# Altium project MB1144C.PrjPCB (part 3 of 4)

## Sheet STPMS2&PT100.SchDoc: STPMS2&PT100
size A3; DocumentNumber: MB1144; Revision: C-02; SheetNumber: 21; SheetTotal: 25; Project: STM32L476G-EVAL; ModifiedDate: 9/23/2015
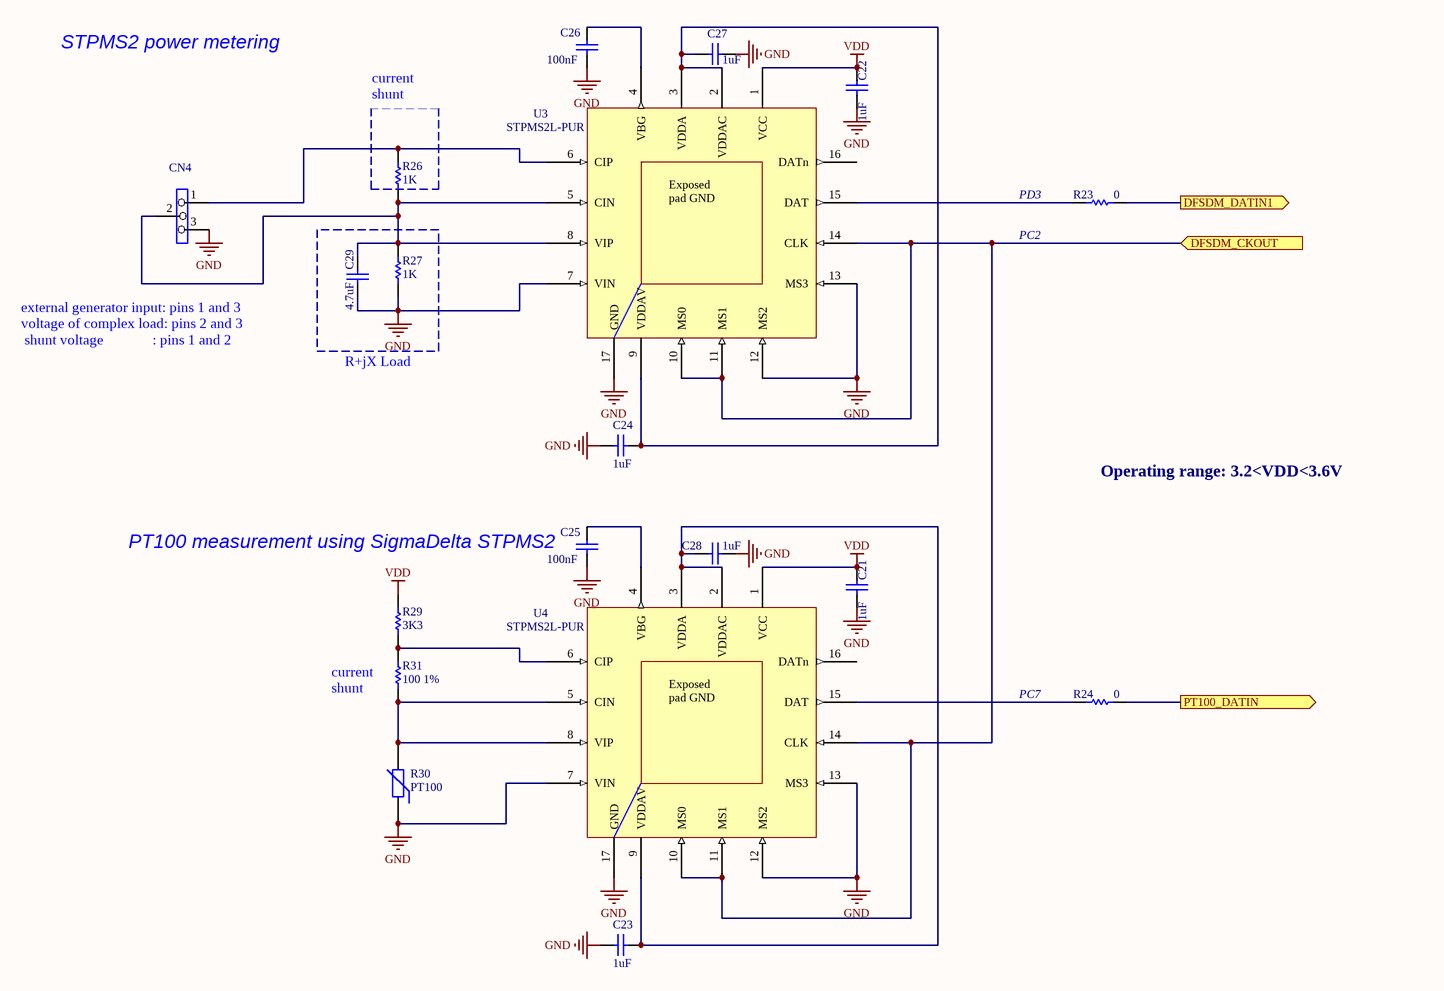
[diagram p15: STPMS2&PT100.SchDoc]

### Parts
C21  1uF  [0603C]
C22  1uF  [0603C]
C23  1uF  [0603C]
C24  1uF  [0603C]
C25  100nF  [0402C]
C26  100nF  [0402C]
C27  1uF  [0603C]
C28  1uF  [0603C]
C29  4.7uF  [0603C]
CN4  Header 3X1  [SIP3]  (value not drawn)
R23  0  [0603R]
R24  0  [0603R]
R26  1K  [0402R]
R27  1K  [0402R]
R29  3K3  [0402R]
R30  PT100  [HDR_1X2_1R27]
R31  100 1%  [0603R]
U3  STPMS2L-PUR  [QFN16_0R65_4X4]
U4  STPMS2L-PUR  [QFN16_0R65_4X4]

### Ports
DFSDM_CKOUT (in), DFSDM_DATIN1 (out), PT100_DATIN (out)

### Nets
GND: C21.2 C22.2 C23.1 C24.1 C25.1 C26.1 C27.2 C28.2 C29.2 CN4.3 R27.2 R30.1 U3.7(VIN) U3.12(MS2) U3.13(MS3) U3.17(GND) U4.7(VIN) U4.12(MS2) U4.13(MS3) U4.17(GND)
VDD: C21.1 C22.1 R29.1 U3.1(VCC) U4.1(VCC)
PD3: R23.1 ; port DFSDM_DATIN1
NetC23_2: C23.2 C28.1 U4.2(VDDAC) U4.3(VDDA) U4.9(VDDAV)
NetC24_2: C24.2 C27.1 U3.2(VDDAC) U3.3(VDDA) U3.9(VDDAV)
NetC25_2: C25.2 U4.4(VBG)
NetC26_2: C26.2 U3.4(VBG)
NetC29_1: C29.1 CN4.2 R26.2 R27.1 U3.5(CIN) U3.8(VIP)
NetCN4_1: CN4.1 R26.1 U3.6(CIP)
NetCN11_28: U3.10(MS0) U3.11(MS1) U3.14(CLK) U4.10(MS0) U4.11(MS1) U4.14(CLK) ; port DFSDM_CKOUT
NetR23_2: R23.2 U3.15(DAT)
NetR24_1: R24.1 ; port PT100_DATIN
NetR24_2: R24.2 U4.15(DAT)
NetR29_2: R29.2 R31.1 U4.6(CIP)
NetR30_2: R30.2 R31.2 U4.5(CIN) U4.8(VIP)

Not connected (* = marked no-connect by the designer): U3 16(DATn); U4 16(DATn)

### Notes on the sheet
- STPMS2 power metering
- current shunt
- (near R23) PD3
- PC2
- external generator input: pins 1 and 3
  voltage of complex load: pins 2 and 3
  shunt voltage              : pins 1 and 2
- R+jX Load
- PT100 measurement using SigmaDelta STPMS2
- Operating range: 3.2<VDD<3.6V
- (near R31) current shunt
- (near R24) PC7
- Title:
- Project:
- Size:
- Date:
- A3
- Reference:
- Sheet:
- Revision:
- of
- (in symbol STPMS2) Exposed pad GND

### Library data of the parts
C21-C24 C27-C29 = CAP: as C58 on sheet MCU2; Published: 8-Jun-2000; Revision: July-2002: Re-released for DXP Platform.; Publisher: Altium Limited
C25 C26 = Cap: as C12 on sheet SRAM&Flash; Published: 8-Jun-2000; Revision: July-2002: Re-released for DXP Platform.; Publisher: Altium Limited
CN4 = Jumper3: Ordered by: Subcon; ECCN_US/EU: NA
R23 R24 = res1: as R35 on sheet MCU2; Published: 8-Jun-2000; Revision: July-2002: Re-released for DXP Platform.; Publisher: Altium Limited
R26 R27 = Res1: as R268 on sheet ST_LINK; Published: 8-Jun-2000; Revision: July-2002: Re-released for DXP Platform.; Publisher: Altium Limited; Value: 1K
R29 R31 = Res1: as R33 on sheet MCU2; Published: 8-Jun-2000; Revision: July-2002: Re-released for DXP Platform.; Publisher: Altium Limited
R30 = PT100: Varistor (Voltage-Sensitive Resistor); ECCN_US/EU: NA; Ordered by: Subcon; Published: 24-Mar-1999; Revision: July-2002: Re-released for DXP Platform.; Publisher: Altium Limited
U3 U4 = STPMS2: STM sigmaDelta modulator; Ordered by: ST; ECCN_US/EU: EAR99/NEC; Ref St: 9177717; Manuf_1: ST; Manuf_Part_1: STPMS2L-PUR

## Sheet IDD_measurement.SchDoc: IDD_measurement
size A3; DocumentNumber: MB1144; Revision: C-02; SheetNumber: 19; SheetTotal: 25; Project: STM32L476G-EVAL; ModifiedDate: 9/23/2015
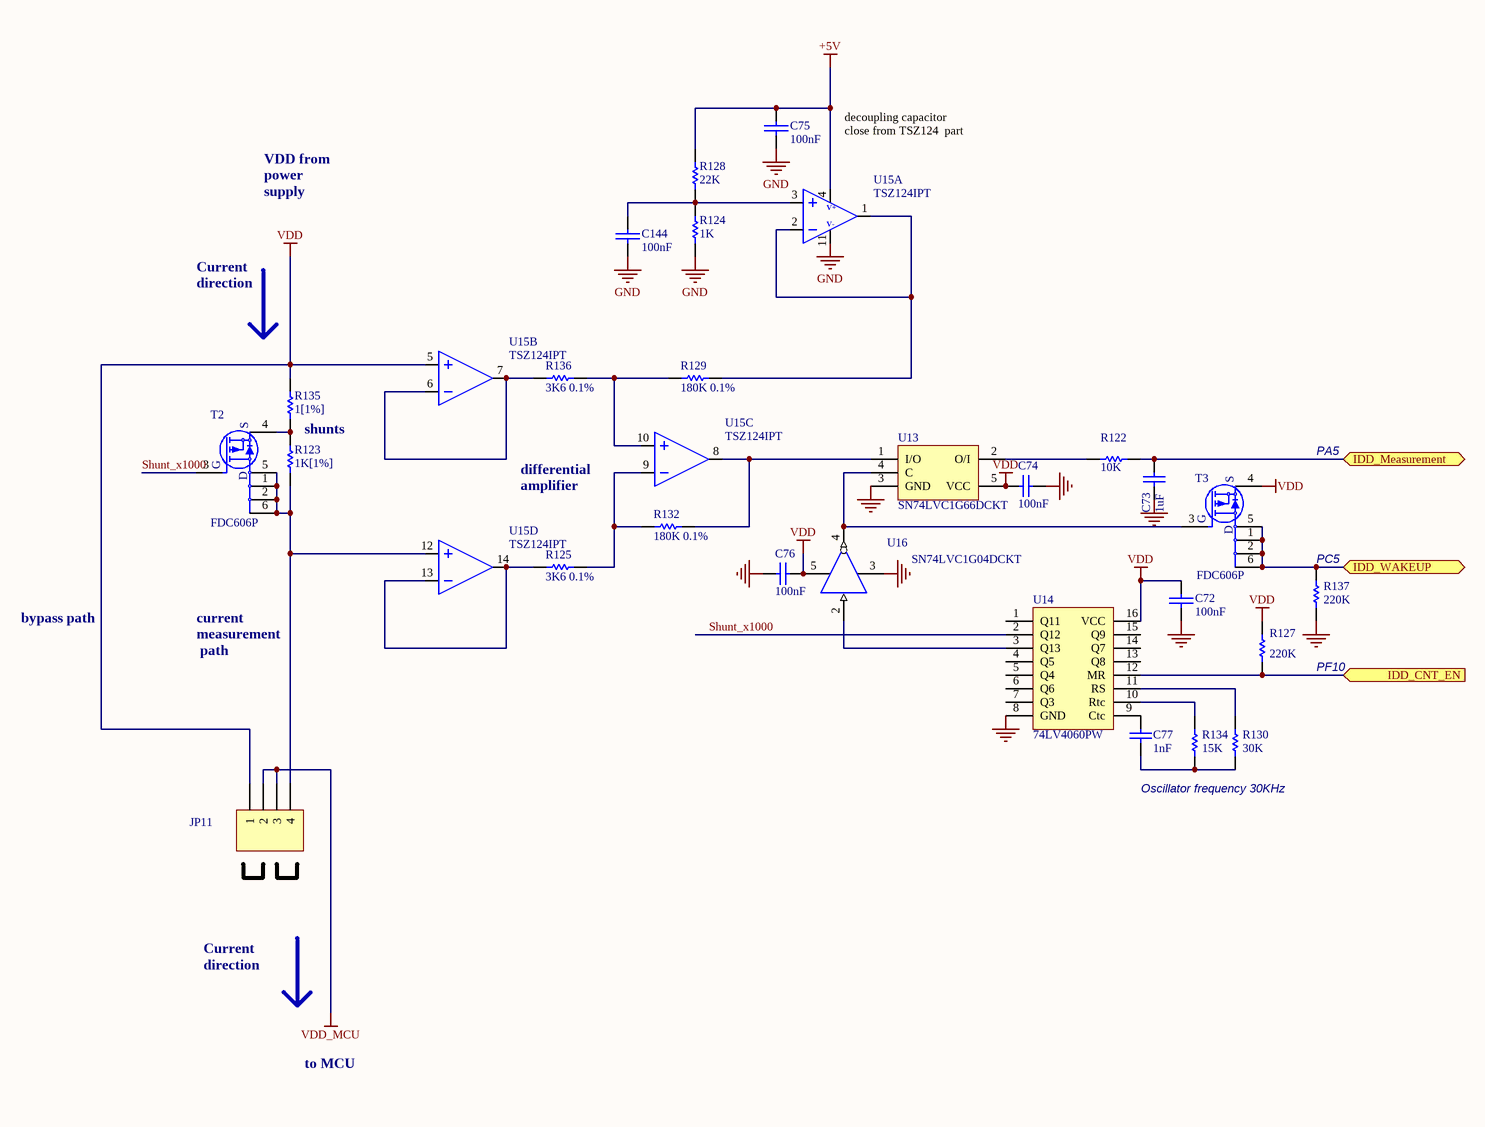
[diagram p16: IDD_measurement.SchDoc]

### Parts
C72  100nF  [0402C]
C73  1uF  [0603C]
C74  100nF  [0402C]
C75  100nF  [0402C]
C76  100nF  [0402C]
C77  1nF  [0402C]
C144  100nF  [0402C]
JP11  Header 4  [SIP4]  (value not drawn)
R122  10K  [0402R]
R123  1K[1%]  [0603R]
R124  1K  [0402R]
R125  3K6 0.1%  [0402R]
R127  220K  [0402R]
R128  22K  [0402R]
R129  180K 0.1%  [0402R]
R130  30K  [0402R]
R132  180K 0.1%  [0402R]
R134  15K  [0402R]
R135  1[1%]  [0603R]
R136  3K6 0.1%  [0402R]
R137  220K  [0402R]
T2  FDC606P  [SOT23-6]
T3  FDC606P  [SOT23-6]
U13  SN74LVC1G66DCKT  [SC70-5]
U14  74LV4060PW  [TSSOP16_0R65_5x6R4]
U15  TSZ124IPT  [TSSOP14_0R65_5X6R4]  (parts A,B,C,D of 4)
U16  SN74LVC1G04DCKT  [SC70-5]

### Ports
IDD_CNT_EN (in), IDD_Measurement, IDD_WAKEUP

### Nets
+5V: C75.1 R128.1 U15.4
GND: C72.2 C73.2 C74.1 C75.2 C76.2 C144.2 R124.2 R137.2 U13.3(GND) U14.8(GND) U15.11 U16.3(GND)
VDD: C72.1 C74.2 C76.1 JP11.1 R127.1 R135.2 T3.4(S) U13.5(VCC) U14.16(VCC) U15.5 U16.5(VCC)
VDD_MCU: JP11.2 JP11.3
Shunt_x1000: T2.3(G) U14.2(Q12)
NetC73_1: C73.1 R122.2 ; port IDD_Measurement
NetC77_1: C77.1 U14.9(Ctc)
NetC77_2: C77.2 R130.2 R134.2
NetC144_1: C144.1 R124.1 R128.2 U15.3
NetJP11_4: JP11.4 R123.1 T2.1(D) T2.2(D) T2.5(D) T2.6(D) U15.12
NetR91_1: R127.2 U14.12(MR) ; port IDD_CNT_EN
NetR122_1: R122.1 U13.2(O/I)
NetR123_2: R123.2 R135.1 T2.4(S)
NetR125_1: R125.1 U15.13 U15.14
NetR125_2: R125.2 R132.1 U15.9
NetR129_1: R129.1 R136.2 U15.10
NetR129_2: R129.2 U15.1 U15.2
NetR130_1: R130.1 U14.11(RS)
NetR132_2: R132.2 U13.1(I/O) U15.8
NetR134_1: R134.1 U14.10(Rtc)
NetR136_1: R136.1 U15.6 U15.7
NetR137_1: R137.1 T3.1(D) T3.2(D) T3.5(D) T3.6(D) ; port IDD_WAKEUP
NetT3_3: T3.3(G) U13.4(C) U16.4(1Y)
NetU14_3: U14.3(Q13) U16.2(1A)

Not connected (* = marked no-connect by the designer): U14 1(Q11) 4(Q5) 5(Q4) 6(Q6) 7(Q3) 13(Q8) 14(Q7) 15(Q9); U16 1(NC)

### Notes on the sheet
- decoupling capacitor
  close from TSZ124  part
- VDD from power supply
- Current direction
- shunts
- PA5
- differential
  amplifier
- (near R137) PC5
- bypass path
- current
  measurement
  path
- PF10
- Oscillator frequency 30KHz
- to MCU
- Title:
- Project:
- Size:
- Date:
- A3
- Reference:
- Sheet:
- Revision:
- of
- (in symbol AOP-14PINS, part A) V+; V-

### Library data of the parts
C72 C75 C144 = CAP: Ordered by: Subcon; ECCN_US/EU: NA
C73 = CAP: as C58 on sheet MCU2; Published: 8-Jun-2000; Revision: July-2002: Re-released for DXP Platform.; Publisher: Altium Limited
C74 C76 = CAP: as C141 on sheet MCU2; Published: 8-Jun-2000; Revision: July-2002: Re-released for DXP Platform.; Publisher: Altium Limited
C77 = Cap: as C12 on sheet SRAM&Flash; Published: 8-Jun-2000; Revision: July-2002: Re-released for DXP Platform.; Publisher: Altium Limited
JP11 = Header 4: Header, 4-Pin; Ordered by: Subcon; Revision: 17-Jul-2002: Re-released for DXP Platform.; Publisher: Altium Limited; ECCN_US/EU: n/a
R122 R123 R125 R127-R130 R132 R134-R137 = res1: as R35 on sheet MCU2; Published: 8-Jun-2000; Revision: July-2002: Re-released for DXP Platform.; Publisher: Altium Limited
R124 = res1: Resistor; Ordered by: Subcon; ECCN_US/EU: NA; Published: 8-Jun-2000; Revision: July-2002: Re-released for DXP Platform.; Publisher: Altium Limited; Value: 1K
T2 T3 = STT5PF20V: Manuf_1: Fairchild; Ordered by: Subcon; ECCN_US/EU: EAR99/NEC; Manuf_Part_1: FDC606P
U13 = 74H1G66STR: Manuf_1: TI; Ordered by: Subcon; ECCN_US/EU: EAR99/NEC; Manuf_Part_1: SN74LVC1G66DCKT
U14 = M74HC4060TTR: Manuf_1: NXP; Ordered by: Subcon; ECCN_US/EU: EAR99/NEC; Manuf_Part_1: 74LV4060PW
U15 = AOP-14PINS: Very high accuracy (5 µV) zero drift 5 V quad OpAmp; Ordered by: ST; ECCN_US/EU: EAR99/NEC; Ref St: 9177442; Order: TSZ124IPT; Manuf_1: ST; Manuf_Part_1: TSZ124IPT
U16 = 74LX1G04CTR: Manuf_1: TI; Ordered by: Subcon; ECCN_US/EU: EAR99/NEC; Manuf_Part_1: SN74LVC1G04DCKT

## Sheet USB_OTG_FS.SchDoc: USB_OTG_FS
size A4; DocumentNumber: MB1144; Revision: C-02; SheetNumber: 18; SheetTotal: 25; Project: STM32L476G-EVAL; ModifiedDate: 9/23/2015
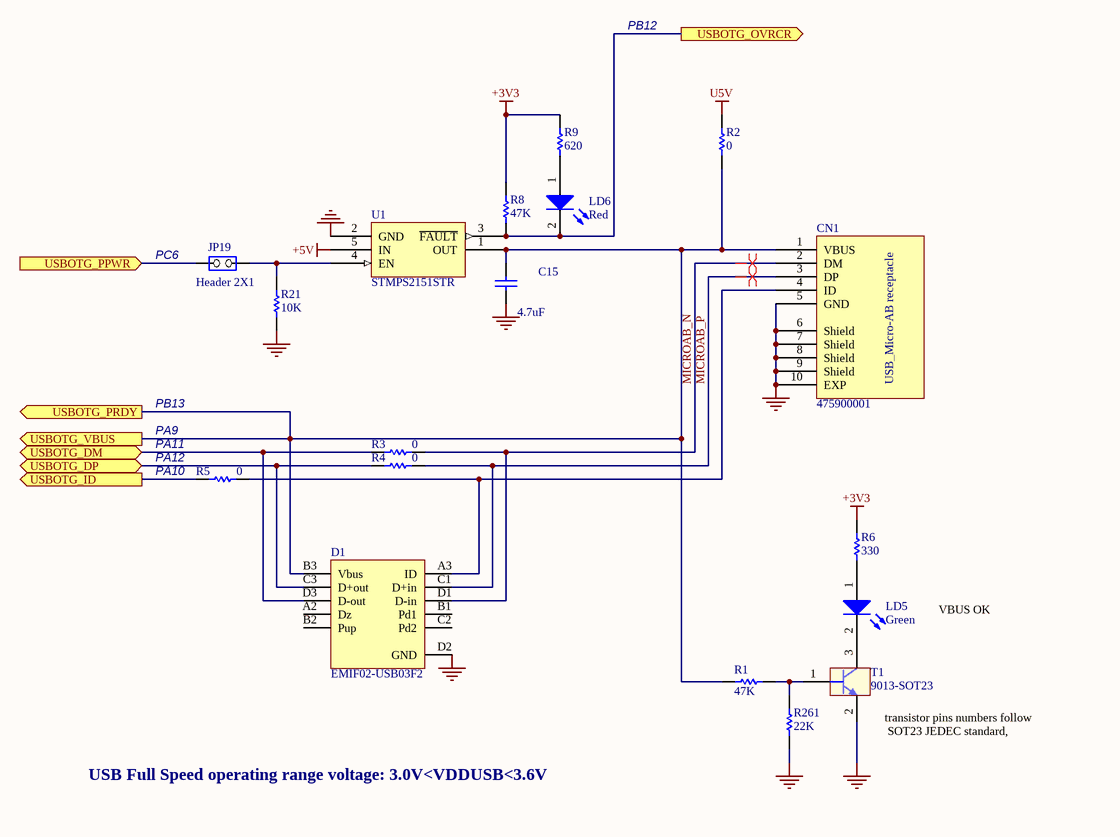
[diagram p17: USB_OTG_FS.SchDoc]

### Parts
C15  4.7uF  [0603C]
CN1  475900001  [MOLEX_47590001]
D1  EMIF02-USB03F2  [BGA11_0R5_1R57X2R07]
JP19  Header 2X1  [SIP2]
LD5  Green  [0603D]
LD6  Red  [0603D]
R1  47K  [0402R]
R2  0  [0603R]
R3  0  [0603R]
R4  0  [0603R]
R5  0  [0603R]
R6  330  [0402R]
R8  47K  [0402R]
R9  620  [0402R]
R21  10K  [0402R]
R261  22K  [0402R]
T1  9013-SOT23  [SOT-23]
U1  STMPS2151STR  [SOT23-5]

### Ports
USBOTG_DM (bidir), USBOTG_DP (bidir), USBOTG_ID (out), USBOTG_OVRCR (out), USBOTG_PPWR (in), USBOTG_PRDY (out), USBOTG_VBUS (out)

### Nets
+3V3: R6.1 R8.1 R9.1
+5V: U1.5(IN)
GND: C15.2 CN1.5(GND) CN1.6(Shield) CN1.7(Shield) CN1.8(Shield) CN1.9(Shield) CN1.10(EXP) D1.D2(GND) R21.1 R261.1 T1.2(E) U1.2(GND)
U5V: R2.1
MICROAB_N: CN1.2(DM) D1.D1(D-in) R3.1
MICROAB_P: CN1.3(DP) D1.C1(D+in) R4.1
PA11: D1.D3(D-out) R3.2 ; port USBOTG_DM
PA12: D1.C3(D+out) R4.2 ; port USBOTG_DP
NetC15_1: C15.1 CN1.1(VBUS) D1.B3(Vbus) R1.1 R2.2 U1.1(OUT) ; port USBOTG_VBUS, port USBOTG_PRDY
NetCN1_4: CN1.4(ID) D1.A3(ID) R5.1
NetCN11_6: R5.2 ; port USBOTG_ID
NetJP19_1: JP19.1(COMMON) ; port USBOTG_PPWR
NetJP19_2: JP19.2(NO) R21.2 U1.4(EN)
NetLD5_1: LD5.1(A) R6.2
NetLD5_2: LD5.2(K) T1.3(C)
NetLD6_1: LD6.1(A) R9.2
NetLD6_2: LD6.2(K) R8.2 U1.3(~{FAULT}) ; port USBOTG_OVRCR
NetR1_2: R1.2 R261.2 T1.1(B)

Not connected (* = marked no-connect by the designer): D1 A2(Dz) B1(Pd1) B2(Pup) C2(Pd2)

### Layout directives
differential pair: MICROAB_N, MICROAB_P

### Notes on the sheet
- PB12
- (near JP19) PC6
- PA9
- (near R5) PA11
- (near R5) PA12
- PB13
- (near R5) PA10
- VBUS OK
- (near T1) transistor pins numbers follow
  SOT23 JEDEC standard,
- USB Full Speed operating range voltage: 3.0V<VDDUSB<3.6V
- Title:
- Project:
- Size:
- Date:
- A4
- Reference:
- Sheet:
- Revision:
- of
- (in symbol 475900001) USB_Micro-AB receptacle

### Library data of the parts
C15 = CAP: as C58 on sheet MCU2; Published: 8-Jun-2000; Revision: July-2002: Re-released for DXP Platform.; Publisher: Altium Limited
CN1 = 475900001: Ordered by: Subcon; ECCN_US/EU: NA; Comments: USB Micro AB receptacle
D1 = EMIF02-USB03F2: Ordered by: ST; ECCN_US/EU: EAR99/NEC; Ref St: 9179037; Manuf_1: ST; Manuf_Part_1: EMIF02-USB03F2
JP19 = JP2: Ordered by: Subcon; ECCN_US/EU: NA
LD5 LD6 = LED2: as LD9 on sheet ST_LINK; Published: 8-Jun-2000; Revision: July-2002: Re-released for DXP Platform.; Publisher: Altium Limited
R1 R6 R8 R9 R261 = res1: as R35 on sheet MCU2; Published: 8-Jun-2000; Revision: July-2002: Re-released for DXP Platform.; Publisher: Altium Limited
R2-R5 R21 = Res1: as R33 on sheet MCU2; Published: 8-Jun-2000; Revision: July-2002: Re-released for DXP Platform.; Publisher: Altium Limited
T1 = 9013-SOT23: as T4 on sheet ST_LINK; Revision: July-2002: Re-released for DXP Platform.; Order: MMBT9013
U1 = STMPS2141STR: Ordered by: ST; ECCN_US/EU: EAR99/NEC; Ref St: 9159009; Manuf_1: ST; Manuf_Part_1: STMPS2151STR

## Sheet Touch Sensing.SchDoc: Touch Sensing
size A4; DocumentNumber: MB1144; Revision: C-02; SheetNumber: 17; SheetTotal: 25; Project: STM32L476G-EVAL; ModifiedDate: 9/23/2015
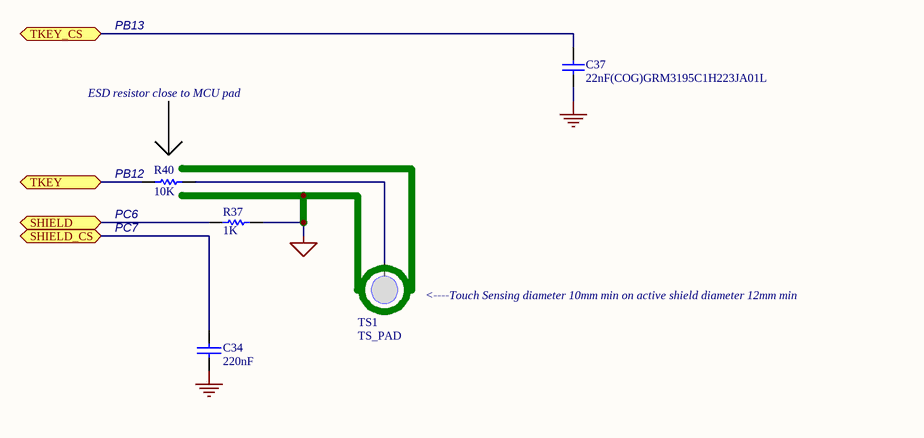
[diagram p18: Touch Sensing.SchDoc]

### Parts
C34  220nF  [0603C]
C37  22nF(COG)GRM3195C1H223JA01L  [1206C]
R37  1K  [0402R]
R40  10K  [0402R]
TS1  TS_PAD  [TS_PAD]

### Ports
SHIELD, SHIELD_CS, TKEY, TKEY_CS

### Nets
GND: C34.1 C37.1
TS_SHIELD: R37.2
NetC34_2: C34.2 ; port SHIELD_CS
NetC37_2: C37.2 ; port TKEY_CS
NetR37_1: R37.1 ; port SHIELD
NetR39_1: R40.1 ; port TKEY
NetR40_2: R40.2 TS1.1

### Notes on the sheet
- PB13
- ESD resistor close to MCU pad
- (near R40) PB12
- (near R40) PC6
- (near R40) PC7
- (near TS1) <----Touch Sensing diameter 10mm min on active shield diameter 12mm min
- Title:
- Project:
- Size:
- Date:
- A4
- Reference:
- Sheet:
- Revision:
- of

### Library data of the parts
C34 = CAP: as C54-C57 on sheet MCU2
C37 = CAP: as C141 on sheet MCU2; Published: 8-Jun-2000; Revision: July-2002: Re-released for DXP Platform.; Publisher: Altium Limited
R37 = Res1: as R268 on sheet ST_LINK; Published: 8-Jun-2000; Revision: July-2002: Re-released for DXP Platform.; Publisher: Altium Limited; Value: 1K
R40 = Res1: as R33 on sheet MCU2; Published: 8-Jun-2000; Revision: July-2002: Re-released for DXP Platform.; Publisher: Altium Limited
TS1 = TS_PAD: Ordered by: Subcon; ECCN_US/EU: NA; Assembly: with transparent plastic cover; Comments: touch sensing button

## Sheet CAN.SchDoc: CAN
size A4; DocumentNumber: MB1144; Revision: C-02; SheetNumber: 16; SheetTotal: 25; Project: STM32L476G-EVAL; ModifiedDate: 9/23/2015
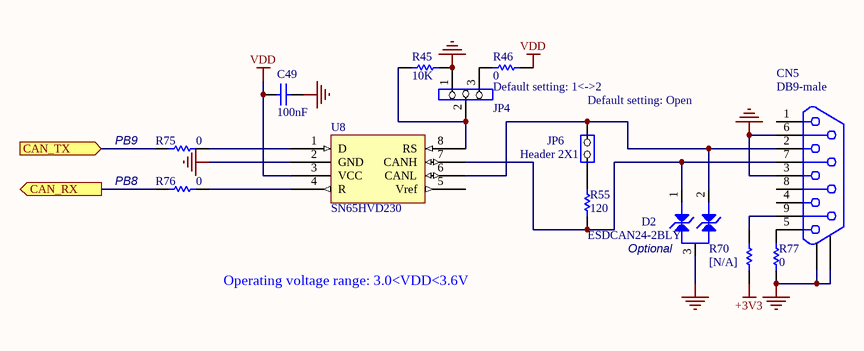
[diagram p19: CAN.SchDoc]

### Parts
C49  100nF  [0402C]
CN5  DB9-male  [DB9/M]
D2  ESDCAN24-2BLY  [SOT23-213]
JP4  Header 3X1  [SIP3]  (value not drawn)
JP6  Header 2X1  [SIP2]
R45  10K  [0402R]
R46  0  [0603R]
R55  120  [0402R]
R70  [N/A]  [0603R]
R75  0  [0603R]
R76  0  [0603R]
R77  0  [0603R]
U8  SN65HVD230  [SOIC8_1R27_4R9X6]

### Ports
CAN_RX (out), CAN_TX (in)

### Nets
+3V3: R70.1
GND: C49.1 CN5.3 CN5.6 CN5.10 CN5.11 D2.3 JP4.1 R45.2 R77.1 U8.2(GND)
VDD: C49.2 R46.2 U8.3(VCC)
NetCN5_2: CN5.2 D2.2 JP6.2(NO) U8.6(CANL)
NetCN5_5: CN5.5 R77.2
NetCN5_7: CN5.7 D2.1 R55.1 U8.7(CANH)
NetCN5_9: CN5.9 R70.2
NetCN11_8: R75.2 ; port CAN_TX
NetCN11_24: R76.1 ; port CAN_RX
NetJP4_2: JP4.2 R45.1 U8.8(RS)
NetJP4_3: JP4.3 R46.1
NetJP6_1: JP6.1(COMMON) R55.2
NetR75_1: R75.1 U8.1(D)
NetR76_2: R76.2 U8.4(R)

Not connected (* = marked no-connect by the designer): CN5 1 4 8; U8 5(Vref)

### Notes on the sheet
- Default setting: 1<->2
- (near JP6) Default setting: Open
- PB9
- PB8
- (near D2) Optional
- Operating voltage range: 3.0<VDD<3.6V
- Title:
- Project:
- Size:
- Date:
- A4
- Reference:
- Sheet:
- Revision:
- of

### Library data of the parts
C49 = CAP: as C54-C57 on sheet MCU2; Published: 8-Jun-2000; Revision: July-2002: Re-released for DXP Platform.; Publisher: Altium Limited; Value: 100nF
CN5 = DB9: Ordered by: Subcon; Comments: DB9 CAN; ECCN_US/EU: NA
D2 = ESDCAN24-2BLY: Ordered by: ST; ECCN_US/EU: EAR99/NEC; Ref St: 9179002; Manuf_1: ST; Manuf_Part_1: ESDCAN24-2BLY
JP4 = Jumper3: Ordered by: Subcon; ECCN_US/EU: NA
JP6 = JP2: Ordered by: Subcon; ECCN_US/EU: NA
R45 R46 R55 R77 = res1: as R35 on sheet MCU2; Published: 8-Jun-2000; Revision: July-2002: Re-released for DXP Platform.; Publisher: Altium Limited
R70 = res1: as R96 on sheet MCU2; Published: 8-Jun-2000; Revision: July-2002: Re-released for DXP Platform.; Publisher: Altium Limited
R75 R76 = Res1: as R33 on sheet MCU2; Published: 8-Jun-2000; Revision: July-2002: Re-released for DXP Platform.; Publisher: Altium Limited
U8 = SN65HVD230D: Manuf_1: TI; Ordered by: Subcon; ECCN_US/EU: EAR99/NEC; Comments: QSPI memory; Manuf_Part_1: SN65HVD230

## Sheet peripherals.SchDoc: peripherals
size A3; DocumentNumber: MB1144; Revision: C-02; SheetNumber: 15; SheetTotal: 25; PageSetup: Record=PageOptions|CenterHorizontal=True|CenterVertical=True|PrintScale=1.39|XCorrection=1.00|YCorrection=1.00|PrintKind=1|BorderSize=5000000|LeftOffset=0|BottomOffset=0|Orientation=2|PaperLength=1000|PaperWidth=1000|Scale=100|PaperSource=264|PrintQuality=600|MediaType=1|DitherType=10|PaperKind=A3|PrintScaleMode=1; Project: STM32L476G-EVAL; ModifiedDate: 9/23/2015
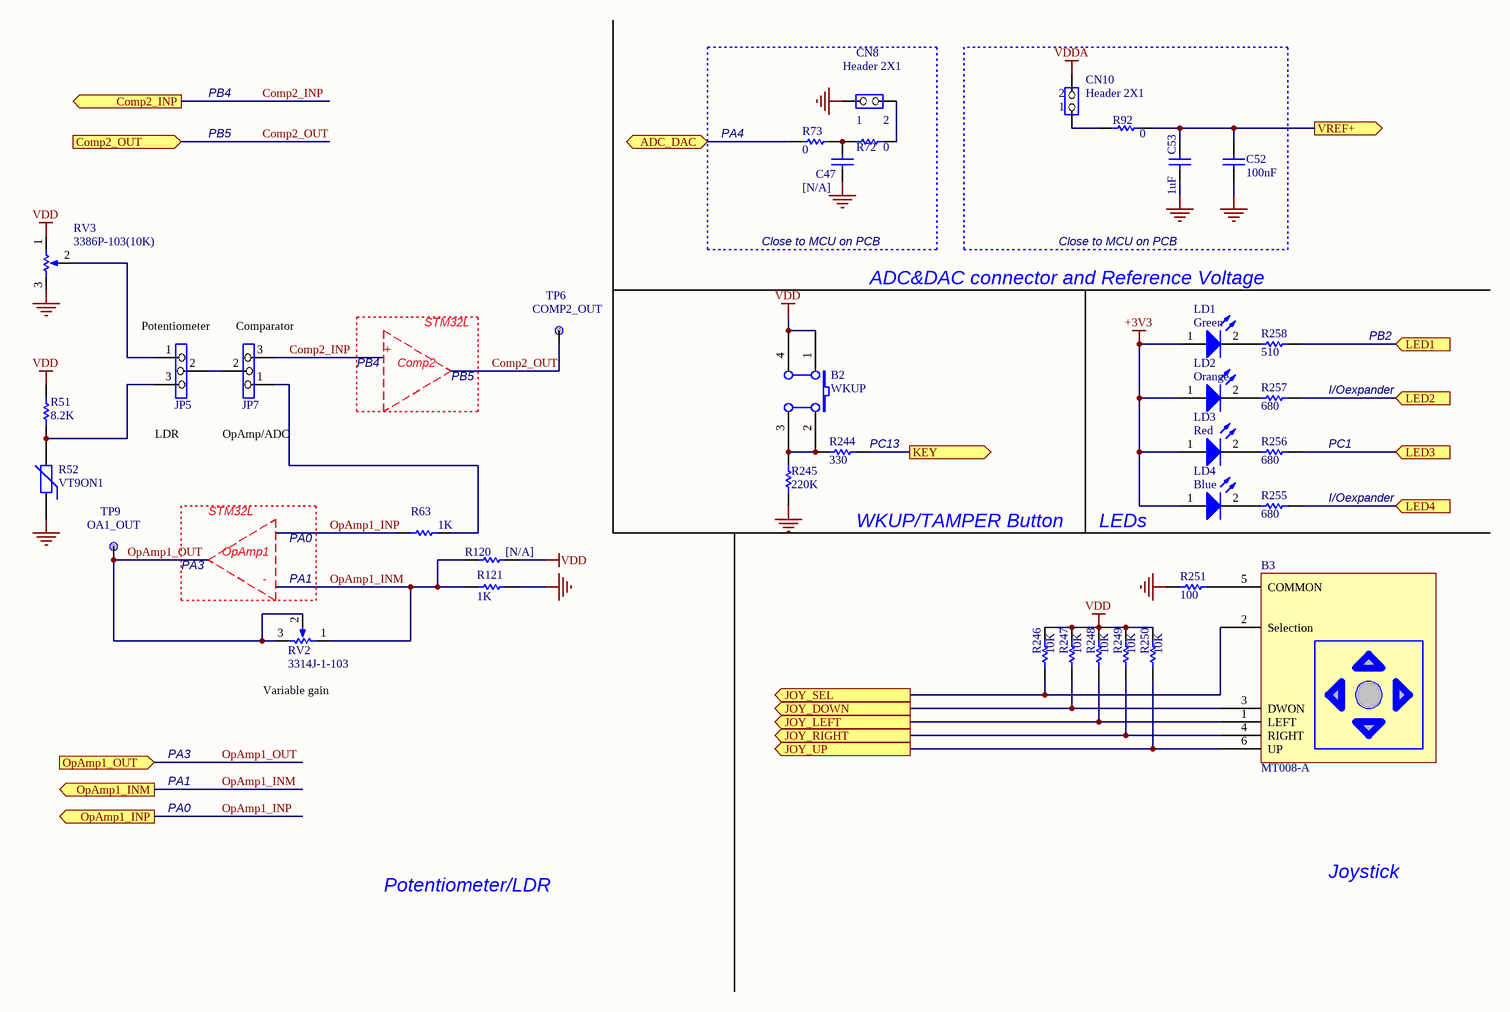
[diagram p20: peripherals.SchDoc]

### Parts
B2  WKUP  [PB10]
B3  MT008-A  [MT-008A]
C47  [N/A]  [0603C]
C52  100nF  [0402C]
C53  1uF  [0603C]
CN8  Header 2X1  [SIP2]
CN10  Header 2X1  [SIP2]
JP5  Header 3X1  [SIP3]  (value not drawn)
JP7  Header 3X1  [SIP3]  (value not drawn)
LD1  Green  [0603D]
LD2  Orange  [0603D]
LD3  Red  [0603D]
LD4  Blue  [0603D]
R51  8.2K  [0402R]
R52  VT9ON1  [PVT901]
R63  1K  [0402R]
R72  0  [0603R]
R73  0  [0603R]
R92  0  [0603R]
R120  [N/A]  [0603R]
R121  1K  [0402R]
R244  330  [0402R]
R245  220K  [0402R]
R246  10K  [0402R]
R247  10K  [0402R]
R248  10K  [0402R]
R249  10K  [0402R]
R250  10K  [0402R]
R251  100  [0402R]
R255  680  [0402R]
R256  680  [0402R]
R257  680  [0402R]
R258  510  [0402R]
RV2  3314J-1-103  [PTF_3314J]
RV3  3386P-103(10K)  [3386P]
TP6  TP Name: COMP2_OUT  [TP]  (hidden comment: [N/A])
TP9  TP Name: OA1_OUT  [TP]  (hidden comment: [N/A])

### Ports
ADC_DAC (bidir), Comp2_INP (out), Comp2_OUT (in), JOY_DOWN (out), JOY_LEFT (out), JOY_RIGHT (out), JOY_SEL (out), JOY_UP (out), KEY (out), LED1 (in), LED2 (in), LED3 (in), LED4 (in), OpAmp1_INM (out), OpAmp1_INP (out), OpAmp1_OUT (in), VREF+ (out)

### Nets
+3V3: LD1.1(A) LD2.1(A) LD3.1(A) LD4.1(A)
GND: C47.1 C52.1 C53.2 CN8.1(COMMON) R52.1 R121.1 R245.2 R251.1 RV3.3(TOP)
VDD: B2.1(A0) B2.4(A1) R51.2 R120.2 R246.1 R247.2 R248.2 R249.2 R250.2 RV3.1(BOT)
VDDA: CN10.2(NO)
Comp2_INP: JP7.3 ; port Comp2_INP
Comp2_OUT: TP6.1 ; port Comp2_OUT
OpAmp1_INM: R120.1 R121.2 RV2.1(BOT) ; port OpAmp1_INM
OpAmp1_INP: R63.2 ; port OpAmp1_INP
OpAmp1_OUT: RV2.2(TAP) RV2.3(TOP) TP9.1 ; port OpAmp1_OUT
PA4: R73.1 ; port ADC_DAC
PC13: R244.2 ; port KEY
NetB2_2: B2.2(B0) B2.3(B1) R244.1 R245.1
NetB3_1: B3.1(LEFT) R248.1 ; port JOY_LEFT
NetB3_2: B3.2(Selection) R246.2 ; port JOY_SEL
NetB3_3: B3.3(DWON) R247.1 ; port JOY_DOWN
NetB3_4: B3.4(RIGHT) R249.1 ; port JOY_RIGHT
NetB3_5: B3.5(COMMON) R251.2
NetB3_6: B3.6(UP) R250.1 ; port JOY_UP
NetC47_2: C47.2 R72.1 R73.2
NetC52_2: C52.2 C53.1 R92.2 ; port VREF+
NetCN8_2: CN8.2(NO) R72.2
NetCN10_1: CN10.1(COMMON) R92.1
NetCN11_30: R256.1 ; port LED3
NetJP5_1: JP5.1 RV3.2(TAP)
NetJP5_2: JP5.2 JP7.2
NetJP5_3: JP5.3 R51.1 R52.2
NetJP7_1: JP7.1 R63.1
NetLD1_2: LD1.2(K) R258.2
NetLD2_2: LD2.2(K) R257.2
NetLD3_2: LD3.2(K) R256.2
NetLD4_2: LD4.2(K) R255.2
NetR54_2: R258.1 ; port LED1
NetR255_1: R255.1 ; port LED4
NetR257_1: R257.1 ; port LED2

### Notes on the sheet
- PB4
- (near CN10) 2
- PB5
- PA4
- 1
- 2
- (near CN10) 1
- Close to MCU on PCB
- ADC&DAC connector and Reference Voltage
- Potentiometer
- (near JP7) Comparator
- +
- Comp2
- STM32L
- PB2
- LDR
- OpAmp/ADC
- I/Oexpander
- (near R244) PC13
- PC1
- PA3
- OpAmp1
- PA0
- WKUP/TAMPER Button
- LEDs
- (near RV2) -
- (near RV2) PA1
- (near RV2) Variable gain
- PA1
- Potentiometer/LDR
- Joystick
- Title:
- Project:
- Size:
- Date:
- A3
- Reference:
- Sheet:
- Revision:
- of

### Library data of the parts
B2 = SW PUSHBUTTON: SE PUSHBUTTON; Ordered by: Subcon; Assembly: Blue; ECCN_US/EU: NA
B3 = MT-008A: Ordered by: Subcon; Assembly: with button; ECCN_US/EU: NA
C47 = cap: Capacitor; Value: 100pF; Ordered by: Subcon; ECCN_US/EU: NA; Fitted: NO; Published: 8-Jun-2000; Revision: July-2002: Re-released for DXP Platform.; Publisher: Altium Limited
C52 = Cap: Capacitor; Value: 10nF; Ordered by: Subcon; ECCN_US/EU: NA; Published: 8-Jun-2000; Revision: July-2002: Re-released for DXP Platform.; Publisher: Altium Limited
C53 = CAP: Capacitor; Value: 100nF; Ordered by: Subcon; ECCN_US/EU: NA; Published: 8-Jun-2000; Revision: July-2002: Re-released for DXP Platform.; Publisher: Altium Limited
CN8 CN10 = JP2: Ordered by: Subcon; ECCN_US/EU: NA
JP5 JP7 = Jumper3: Ordered by: Subcon; ECCN_US/EU: NA
LD1-LD4 = LED2: Typical RED, GREEN, YELLOW, AMBER GaAs LED; Ordered by: Subcon; ECCN_US/EU: NA; Published: 8-Jun-2000; Revision: July-2002: Re-released for DXP Platform.; Publisher: Altium Limited
R51 R72 R73 R92 R244 R246-R251 R255-R258 = Res1: Resistor; Value: 1K; Ordered by: Subcon; ECCN_US/EU: NA; Published: 8-Jun-2000; Revision: July-2002: Re-released for DXP Platform.; Publisher: Altium Limited
R52 = Res Varistor: Varistor (Voltage-Sensitive Resistor); ECCN_US/EU: NA; Ordered by: Subcon; Published: 24-Mar-1999; Revision: July-2002: Re-released for DXP Platform.; Publisher: Altium Limited
R63 R121 = Res1: Resistor; Ordered by: Subcon; ECCN_US/EU: NA; Published: 8-Jun-2000; Revision: July-2002: Re-released for DXP Platform.; Publisher: Altium Limited; Value: 1K
R120 = Res1: Resistor; Value: 1K; Ordered by: Subcon; ECCN_US/EU: NA; Fitted: NO; Published: 8-Jun-2000; Revision: July-2002: Re-released for DXP Platform.; Publisher: Altium Limited
R245 = res1: Resistor; Value: 1K; Ordered by: Subcon; ECCN_US/EU: NA; Published: 8-Jun-2000; Revision: July-2002: Re-released for DXP Platform.; Publisher: Altium Limited
RV2 = RV: Potentiometer 10K; Ordered by: Subcon; Comments: adjustable 10K potentiometer; ECCN_US/EU: NA
RV3 = RV: Potentiometer 10K; Ordered by: Subcon; Comments: 10K potentiometer; ECCN_US/EU: NA
TP6 TP9 = TP: Ordered by: Subcon; Fitted or not fitted: NO; ECCN_US/EU: NA; Fitted: NO

## Sheet Power.SchDoc: Power
size A3; DocumentNumber: MB1144; Revision: C-02; SheetNumber: 7; SheetTotal: 25; Project: STM32L476G-EVAL; ModifiedDate: 9/23/2015
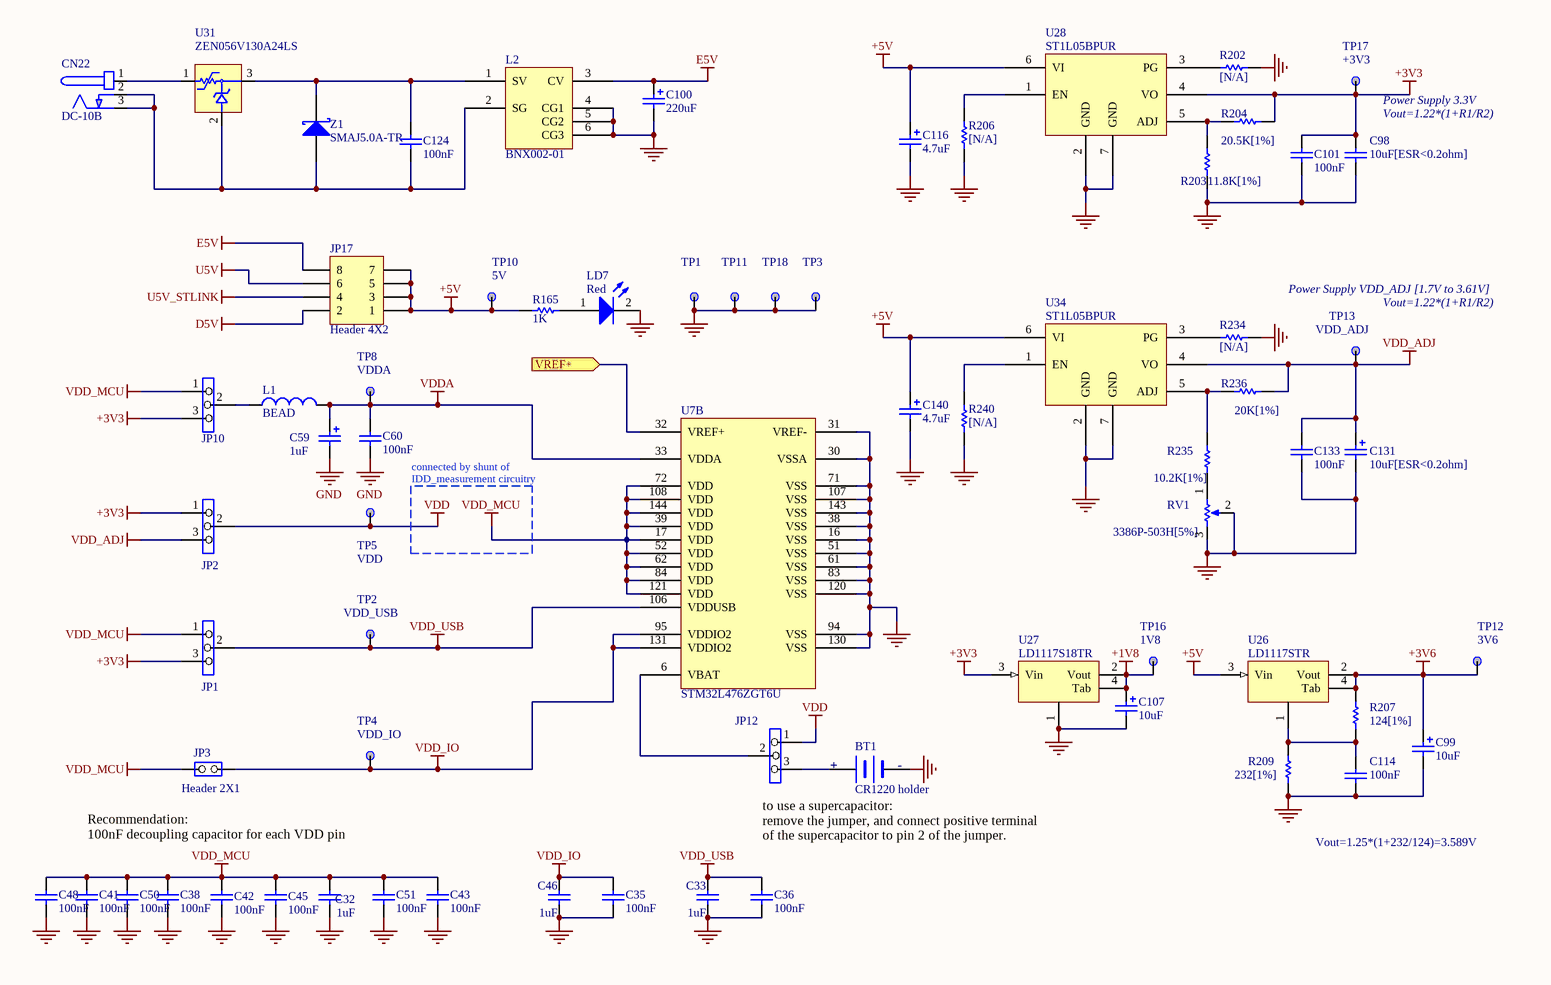
[diagram p21: Power.SchDoc]

### Parts
BT1  CR1220 holder  [BAT_2SM_CR1220]
C32  1uF  [0603C]
C33  1uF  [0603C]
C35  100nF  [0402C]
C36  100nF  [0402C]
C38  100nF  [0402C]
C41  100nF  [0402C]
C42  100nF  [0402C]
C43  100nF  [0402C]
C45  100nF  [0402C]
C46  1uF  [0603C]
C48  100nF  [0402C]
C50  100nF  [0402C]
C51  100nF  [0402C]
C59  1uF  [TAN-A]
C60  100nF  [0402C]
C98  10uF[ESR<0.2ohm]  [0805C]
C99  10uF  [TAN-A]
C100  220uF  [c310m-6]
C101  100nF  [0402C]
C107  10uF  [TAN-A]
C114  100nF  [0402C]
C116  4.7uF  [TAN-A]
C124  100nF  [0402C]
C131  10uF[ESR<0.2ohm]  [0805C]
C133  100nF  [0402C]
C140  4.7uF  [TAN-A]
CN22  DC-10B  [PWR_JACK_DC10]
JP1  Header 3X1  [SIP3]  (value not drawn)
JP2  Header 3X1  [SIP3]  (value not drawn)
JP3  Header 2X1  [SIP2]
JP10  Header 3X1  [SIP3]  (value not drawn)
JP12  Header 3X1  [SIP3]  (value not drawn)
JP17  Header 4X2  [HDR_2X4_2R54]
L1  BEAD  [0603L]
L2  BNX002-01  [BNX001]
LD7  Red  [0603D]
R165  1K  [0402R]
R202  [N/A]  [0603R]
R203  11.8K[1%]  [0603R]
R204  20.5K[1%]  [0603R]
R206  [N/A]  [0603R]
R207  124[1%]  [0603R]
R209  232[1%]  [0603R]
R234  [N/A]  [0603R]
R235  10.2K[1%]  [0603R]
R236  20K[1%]  [0603R]
R240  [N/A]  [0603R]
RV1  3386P-503H[5%]  [3386P]
TP1  [N/A]  [TP]  (value not drawn)
TP2  TP Name: VDD_USB  [TP]  (hidden comment: [N/A])
TP3  [N/A]  [TP]  (value not drawn)
TP4  TP Name: VDD_IO  [TP]  (hidden comment: [N/A])
TP5  TP Name: VDD  [TP]  (hidden comment: [N/A])
TP8  TP Name: VDDA  [TP]  (hidden comment: [N/A])
TP10  TP Name: 5V  [TP]  (hidden comment: [N/A])
TP11  [N/A]  [TP]  (value not drawn)
TP12  TP Name: 3V6  [TP]  (hidden comment: [N/A])
TP13  TP Name: VDD_ADJ  [TP]  (hidden comment: [N/A])
TP16  TP Name: 1V8  [TP]  (hidden comment: [N/A])
TP17  TP Name: +3V3  [TP]  (hidden comment: [N/A])
TP18  [N/A]  [TP]  (value not drawn)
U7  STM32L476ZGT6U  [TQFP144_0R5_22X22_SOCKET]  (part B of 3)
U26  LD1117STR  [SOT-223]
U27  LD1117S18TR  [SOT-223]
U28  ST1L05BPUR  [DFN6_0R95_3X3]
U31  ZEN056V130A24LS  [TYCO_ZEN056V130A24LS]
U34  ST1L05BPUR  [DFN6_0R95_3X3]
Z1  SMAJ5.0A-TR  [sma]

### Ports
VREF+ (in)

### Nets
+1V8: C107.1 TP16.1 U27.2(Vout) U27.4(Tab)
+3V3: C98.1 C101.1 JP1.3 JP2.1 JP10.3 R204.1 TP17.1 U27.3(Vin) U28.4(VO)
+3V6: C99.1 R207.2 TP12.1 U26.2(Vout) U26.4(Tab)
+5V: C116.1 C140.1 JP17.1 JP17.3 JP17.5 JP17.7 R165.2 TP10.1 U26.3(Vin) U28.6(VI) U34.6(VI)
D5V: JP17.2
E5V: C100.1 JP17.8 L2.3(CV)
GND: BT1.2(-) C32.2 C33.2 C35.1 C36.1 C38.1 C41.1 C42.2 C43.1 C45.2 C46.2 C48.1 C50.1 C51.1 C59.2 C60.1 C98.2 C99.2 C100.2 C101.2 C107.2 C114.2 C116.2 C131.2 C133.2 C140.2 L2.4(CG1) L2.5(CG2) L2.6(CG3) LD7.2(K) R202.1 R203.2 R206.2 R209.1 R234.1 R240.2 RV1.2(TAP) RV1.3(TOP) TP1.1 TP3.1 TP11.1 TP18.1 U7.16(VSS) U7.30(VSSA) U7.31(VREF-) U7.38(VSS) U7.51(VSS) U7.61(VSS) U7.71(VSS) U7.83(VSS) U7.94(VSS) U7.107(VSS) U7.120(VSS) U7.130(VSS) U7.143(VSS) U27.1 U28.2(GND) U28.7(GND) U34.2(GND) U34.7(GND)
U5V: JP17.6
U5V_STLINK: JP17.4
VDD: JP2.2 JP12.1 TP5.1
VDD_ADJ: C131.1 C133.1 JP2.3 R236.1 TP13.1 U34.4(VO)
VDD_IO: C35.2 C46.1 JP3.2(NO) TP4.1 U7.95(VDDIO2) U7.131(VDDIO2)
VDD_MCU: C32.1 C38.2 C41.2 C42.1 C43.2 C45.1 C48.2 C50.2 C51.2 JP1.1 JP3.1(COMMON) JP10.1 U7.17(VDD) U7.39(VDD) U7.52(VDD) U7.62(VDD) U7.72(VDD) U7.84(VDD) U7.108(VDD) U7.121(VDD) U7.144(VDD)
VDD_USB: C33.1 C36.2 JP1.2 TP2.1 U7.106(VDDUSB)
VDDA: C59.1 C60.2 L1.2 TP8.1 U7.33(VDDA)
NetBT1_1: BT1.1(+) JP12.3
NetC52_2: U7.32(VREF+) ; port VREF+
NetC114_1: C114.1 R207.1 R209.2 U26.1
NetC124_1: C124.1 L2.1(SV) U31.3 Z1.2(K)
NetC124_2: C124.2 CN22.2(GND) CN22.3(GND) L2.2(SG) U31.2 Z1.1(A)
NetCN22_1: CN22.1(+) U31.1
NetJP10_2: JP10.2 L1.1
NetJP12_2: JP12.2 U7.6(VBAT)
NetLD7_1: LD7.1(A) R165.1
NetR202_2: R202.2 U28.3(PG)
NetR203_1: R203.1 R204.2 U28.5(ADJ)
NetR206_1: R206.1 U28.1(EN)
NetR234_2: R234.2 U34.3(PG)
NetR235_1: R235.1 R236.2 U34.5(ADJ)
NetR235_2: R235.2 RV1.1(BOT)
NetR240_1: R240.1 U34.1(EN)

### Notes on the sheet
- Power Supply 3.3V
- Vout=1.22*(1+R1/R2)
- Power Supply VDD_ADJ [1.7V to 3.61V]
- (near TP13) Vout=1.22*(1+R1/R2)
- connected by shunt of
  IDD_measurement circuitry
- (near BT1) +
- (near BT1) -
- Recommendation:
  100nF decoupling capacitor for each VDD pin
- to use a supercapacitor:
  remove the jumper, and connect positive terminal
  of the supercapacitor to pin 2 of the jumper.
- Vout=1.25*(1+232/124)=3.589V
- Title:
- Project:
- Size:
- Date:
- A3
- Reference:
- Sheet:
- Revision:
- of

### Library data of the parts
BT1 = BATTERY: Ordered by: Subcon; Assembly: with battery; ECCN_US/EU: NA
C32 C33 C46 = CAP: as C53 on sheet peripherals; Published: 8-Jun-2000; Revision: July-2002: Re-released for DXP Platform.; Publisher: Altium Limited
C35 C36 C60 C98 C101 C114 C133 = Cap: as C52 on sheet peripherals; Published: 8-Jun-2000; Revision: July-2002: Re-released for DXP Platform.; Publisher: Altium Limited
C38 C41-C43 C45 C48 C50 C51 = CAP: Capacitor; Ordered by: Subcon; ECCN_US/EU: NA; Published: 8-Jun-2000; Revision: July-2002: Re-released for DXP Platform.; Publisher: Altium Limited; Value: 100nF
C59 C131 = Cap Pol1: Polarized Capacitor (Radial); Value: 10uF; Ordered by: Subcon; ECCN_US/EU: NA; Published: 8-Jun-2000; Revision: July-2002: Re-released for DXP Platform.; Publisher: Altium Limited
C99 = Cap Pol1: Polarized Capacitor (Radial); ECCN_US/EU: NA; Ordered by: Subcon; Published: 8-Jun-2000; Revision: July-2002: Re-released for DXP Platform.; Publisher: Altium Limited; Value: 10uF
C100 = Cap Pol1: Polarized Capacitor (Radial); Value: 47uF; Ordered by: Subcon; ECCN_US/EU: NA; Published: 8-Jun-2000; Revision: July-2002: Re-released for DXP Platform.; Publisher: Altium Limited
C107 = Cap Pol1: Polarized Capacitor (Radial); Ordered by: Subcon; ECCN_US/EU: NA; Published: 8-Jun-2000; Revision: July-2002: Re-released for DXP Platform.; Publisher: Altium Limited; Value: 10uF
C116 C140 = Cap Pol1: Polarized Capacitor (Radial); Value: 100pF; Ordered by: Subcon; ECCN_US/EU: NA; Published: 8-Jun-2000; Revision: July-2002: Re-released for DXP Platform.; Publisher: Altium Limited
C124 = CAP: Capacitor; Value: 100pF; Ordered by: Subcon; ECCN_US/EU: NA; Published: 8-Jun-2000; Revision: July-2002: Re-released for DXP Platform.; Publisher: Altium Limited
CN22 = PJ202A: Ordered by: Subcon; Comments: power jack; ECCN_US/EU: NA
JP1 JP2 JP10 JP12 = Jumper3: Ordered by: Subcon; ECCN_US/EU: NA
JP3 = JP2: Ordered by: Subcon; ECCN_US/EU: NA
JP17 = Header 4X2: Header, 4-Pin, Dual row; Ordered by: Subcon; ECCN_US/EU: NA; Revision: 17-Jul-2002: Re-released for DXP Platform.; Publisher: Altium Limited
L1 = Inductor: Value: 100uH; Ordered by: Subcon; ECCN_US/EU: NA; Published: 8-Jun-2000; Revision: July-2002: Re-released for DXP Platform.; Publisher: Altium Limited
L2 = BNX002: Ordered by: Subcon; ECCN_US/EU: NA
LD7 = LED2: as LD1-LD4 on sheet peripherals; Published: 8-Jun-2000; Revision: July-2002: Re-released for DXP Platform.; Publisher: Altium Limited
R165 = res1: Resistor; Ordered by: Subcon; ECCN_US/EU: NA; Published: 8-Jun-2000; Revision: July-2002: Re-released for DXP Platform.; Publisher: Altium Limited; Value: 1K
R202 R206 R234 R240 = res1: Resistor; Value: 1K; Ordered by: Subcon; ECCN_US/EU: NA; Fitted: NO; Published: 8-Jun-2000; Revision: July-2002: Re-released for DXP Platform.; Publisher: Altium Limited
R203 R204 R235 R236 = Res1: as R51 on sheet peripherals; Published: 8-Jun-2000; Revision: July-2002: Re-released for DXP Platform.; Publisher: Altium Limited
R207 R209 = Res1: Resistor; Value: 1K; ECCN_US/EU: NA; Ordered by: Subcon; Published: 8-Jun-2000; Revision: July-2002: Re-released for DXP Platform.; Publisher: Altium Limited
RV1 = RV: Potentiometer 50K; Ordered by: Subcon; Comments: 50K potentiometer; ECCN_US/EU: NA
TP1 TP3 TP11 TP18 = TP: TP Name: GND; Ordered by: Subcon; Fitted or not fitted: NO; ECCN_US/EU: NA; Fitted: NO
TP2 TP4 TP5 TP8 TP10 TP12 TP13 TP16 TP17 = TP: as TP6 on sheet peripherals
U7 = STM32L476_TQFP144: Manuf_Part_1: STM32L476ZGT6U cut1.3; Ordered by: ST; ECCN_US/EU: 3A991A2/NEC; Assembly: MCU; Ref St: 9175195; Manuf_1: ST
U26 = LD1117: Ordered by: ST; ECCN_US/EU: EAR99/NEC; Ref St: 9176138; Manuf_1: ST; Manuf_Part_1: LD1117STR
U27 = LD1117: Ordered by: ST; ECCN_US/EU: EAR99/NEC; Ref St: 9176180; Manuf_1: ST; Manuf_Part_1: LD1117S18TR
U28 U34 = ST1L05: Ordered by: ST; ECCN_US/EU: EAR99/NEC; Ref St: 9176239; Manuf_1: ST; Manuf_Part_1: ST1L05BPUR
U31 = ZEN056V130A24LS: Manuf_1: TYCO; Ordered by: Subcon; ECCN_US/EU: EAR99/NEC; Manuf_Part_1: ZEN056V130A24LS
Z1 = D Schottky: Schottky Diode; Code - JEDEC: DO-214-AA; Ordered by: ST; ECCN_US/EU: EAR99/NEC; Ref St: 9151107; Published: 8-Jun-2000; Revision: July-2002: Re-released for DXP Platform.; Publisher: Altium Limited; Manuf_1: ST; Manuf_Part_1: SMAJ5.0A-TR

## Sheet Audio.SchDoc: Audio
size A3; DocumentNumber: MB1144; Revision: C-02; SheetNumber: 20; SheetTotal: 25; Project: STM32L476G-EVAL; ModifiedDate: 9/23/2015
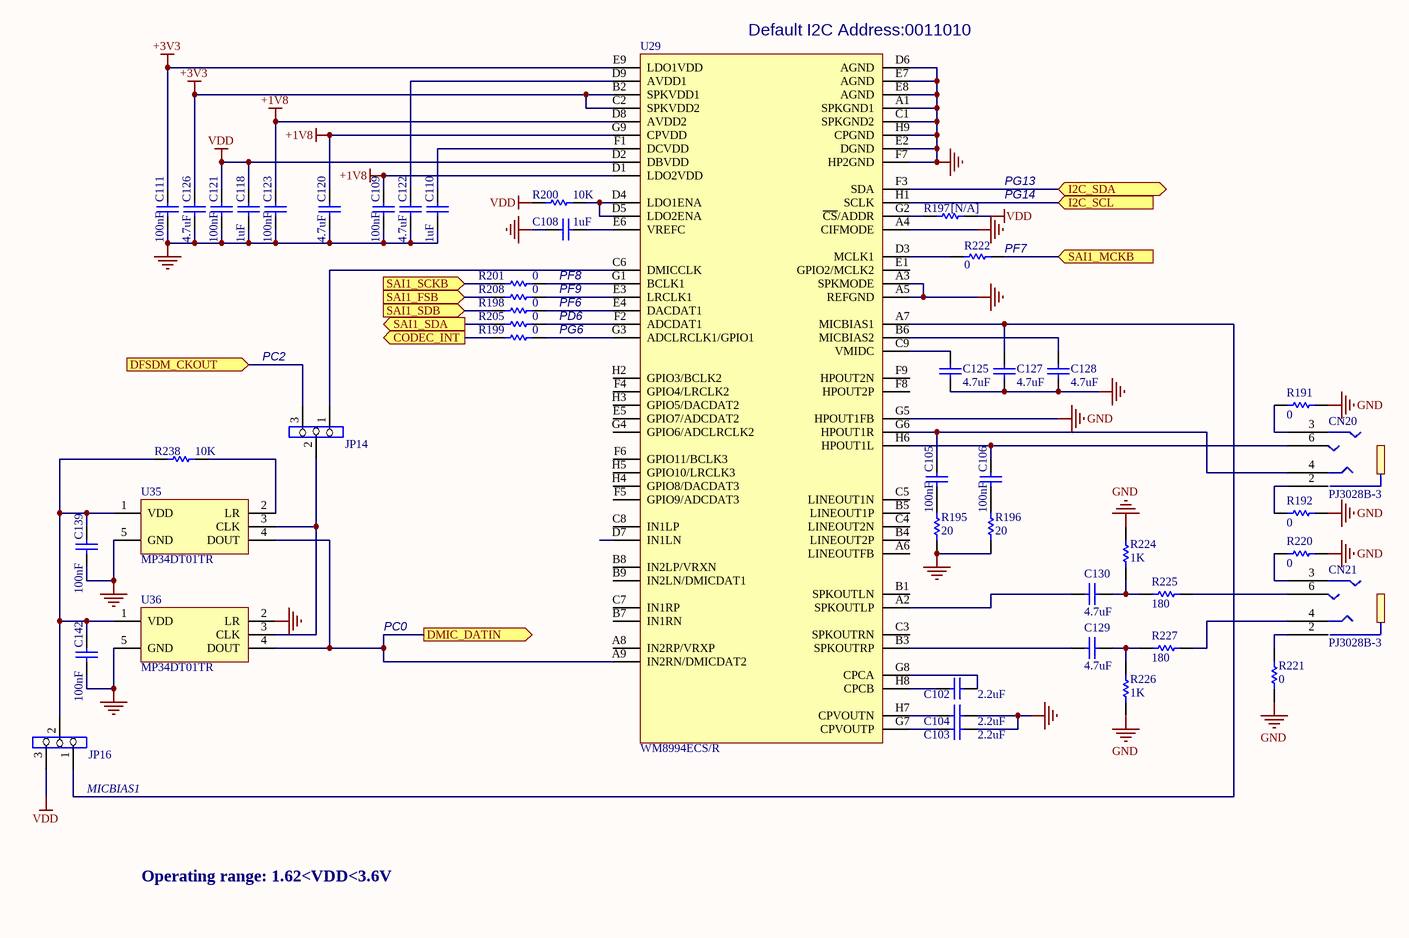
[diagram p22: Audio.SchDoc]

### Parts
C102  2.2uF  [0603C]
C103  2.2uF  [0603C]
C104  2.2uF  [0603C]
C105  100nF  [0402C]
C106  100nF  [0402C]
C108  1uF  [0603C]
C109  100nF  [0402C]
C110  1uF  [0603C]
C111  100nF  [0402C]
C118  1uF  [0603C]
C120  4.7uF  [0603C]
C121  100nF  [0402C]
C122  4.7uF  [0603C]
C123  100nF  [0402C]
C125  4.7uF  [0603C]
C126  4.7uF  [0603C]
C127  4.7uF  [0603C]
C128  4.7uF  [0603C]
C129  4.7uF  [0603C]
C130  4.7uF  [0603C]
C139  100nF  [0402C]
C142  100nF  [0402C]
CN20  PJ3028B-3  [PJ3028B]
CN21  PJ3028B-3  [PJ3028B]
JP14  Header 3X1  [SIP3]  (value not drawn)
JP16  Header 3X1  [SIP3]  (value not drawn)
R191  0  [0603R]
R192  0  [0603R]
R195  20  [0402R]
R196  20  [0402R]
R197  [N/A]  [0603R]
R198  0  [0603R]
R199  0  [0603R]
R200  10K  [0402R]
R201  0  [0603R]
R205  0  [0603R]
R208  0  [0603R]
R220  0  [0603R]
R221  0  [0603R]
R222  0  [0603R]
R224  1K  [0402R]
R225  180  [0402R]
R226  1K  [0402R]
R227  180  [0402R]
R238  10K  [0402R]
U29  WM8994ECS/R  [BGA72_0R5_4R5X4]
U35  MP34DT01TR  [MP34DT01TR]
U36  MP34DT01TR  [MP34DT01TR]

### Ports
CODEC_INT (out), DFSDM_CKOUT (in), DMIC_DATIN (out), I2C_SCL (in), I2C_SDA (bidir), SAI1_FSB (in), SAI1_MCKB (in), SAI1_SCKB (in), SAI1_SDA (out), SAI1_SDB (in)

### Nets
+1V8: C109.1 C120.1 C123.1 U29.D1(LDO2VDD) U29.D8(AVDD2) U29.G9(CPVDD)
+3V3: C111.1 C126.1 U29.B2(SPKVDD1) U29.C2(SPKVDD2) U29.E9(LDO1VDD)
GND: C103.2 C104.2 C108.2 C109.2 C110.2 C111.2 C118.2 C120.2 C121.2 C122.2 C123.2 C125.1 C126.2 C127.1 C128.1 C139.2 C142.2 R191.2 R192.1 R195.2 R196.2 R220.2 R221.2 R224.1 R226.1 U29.A1(SPKGND1) U29.A3(SPKMODE) U29.A4(CIFMODE) U29.A5(REFGND) U29.C1(SPKGND2) U29.D6(AGND) U29.E2(DGND) U29.E7(AGND) U29.E8(AGND) U29.F7(HP2GND) U29.G5(HPOUT1FB) U29.H9(CPGND) U35.5(GND) U36.2(LR) U36.5(GND)
VDD: C118.1 C121.1 JP16.3 R197.1 R200.2 U29.D2(DBVDD)
I2C_SCL: U29.H1(SCLK) ; port I2C_SCL
I2C_SDA: U29.F3(SDA) ; port I2C_SDA
NetC102_1: C102.1 U29.H8(CPCB)
NetC102_2: C102.2 U29.G8(CPCA)
NetC103_1: C103.1 U29.G7(CPVOUTP)
NetC104_1: C104.1 U29.H7(CPVOUTN)
NetC105_1: C105.1 CN20.4 U29.G6(HPOUT1R)
NetC105_2: C105.2 R195.1
NetC106_1: C106.1 CN20.6 U29.H6(HPOUT1L)
NetC106_2: C106.2 R196.1
NetC108_1: C108.1 U29.E6(VREFC)
NetC110_1: C110.1 U29.F1(DCVDD)
NetC122_1: C122.1 U29.D9(AVDD1)
NetC125_2: C125.2 U29.C9(VMIDC)
NetC127_2: C127.2 JP16.1 U29.A7(MICBIAS1)
NetC128_2: C128.2 U29.B6(MICBIAS2)
NetC129_1: C129.1 R226.2 R227.2
NetC129_2: C129.2 U29.B3(SPKOUTRP)
NetC130_1: C130.1 R224.2 R225.1
NetC130_2: C130.2 U29.A2(SPKOUTLP)
NetC139_1: C139.1 C142.1 JP16.2 R238.2 U35.1(VDD) U36.1(VDD)
NetCN11_28: JP14.3 ; port DFSDM_CKOUT
NetCN11_32: U29.A9(IN2RN/DMICDAT2) U35.4(DOUT) U36.4(DOUT) ; port DMIC_DATIN
NetCN20_2: CN20.2 R192.2
NetCN20_3: CN20.3 R191.1
NetCN21_2: CN21.2 R221.1
NetCN21_3: CN21.3 R220.1
NetCN21_4: CN21.4 R227.1
NetCN21_6: CN21.6 R225.2
NetJP14_1: JP14.1 U29.C6(DMICCLK)
NetJP14_2: JP14.2 U35.3(CLK) U36.3(CLK)
NetR35_1: R199.2 ; port CODEC_INT
NetR53_2: R205.2 ; port SAI1_SDA
NetR89_1: R201.2 ; port SAI1_SCKB
NetR90_1: R208.2 ; port SAI1_FSB
NetR105_1: R198.2 ; port SAI1_SDB
NetR106_1: R222.1 ; port SAI1_MCKB
NetR197_2: R197.2 U29.G2(~{CS}/ADDR)
NetR198_1: R198.1 U29.E4(DACDAT1)
NetR199_1: R199.1 U29.G3(ADCLRCLK1/GPIO1)
NetR200_1: R200.1 U29.D4(LDO1ENA) U29.D5(LDO2ENA)
NetR201_1: R201.1 U29.G1(BCLK1)
NetR205_1: R205.1 U29.F2(ADCDAT1)
NetR208_1: R208.1 U29.E3(LRCLK1)
NetR222_2: R222.2 U29.D3(MCLK1)
NetR238_1: R238.1 U35.2(LR)

Not connected (* = marked no-connect by the designer): U29 A6(LINEOUTFB) A8(IN2RP/VRXP) B1(SPKOUTLN) B4(LINEOUT2P) B5(LINEOUT1P) B7(IN1RN) B8(IN2LP/VRXN) B9(IN2LN/DMICDAT1) C3(SPKOUTRN) C4(LINEOUT2N) C5(LINEOUT1N) C7(IN1RP) C8(IN1LP) D7(IN1LN) E1(GPIO2/MCLK2) E5(GPIO7/ADCDAT2) F4(GPIO4/LRCLK2) F5(GPIO9/ADCDAT3) F6(GPIO11/BCLK3) F8(HPOUT2P) F9(HPOUT2N) G4(GPIO6/ADCLRCLK2) H2(GPIO3/BCLK2) H3(GPIO5/DACDAT2) H4(GPIO8/DACDAT3) H5(GPIO10/LRCLK3)

### Notes on the sheet
- (near U29) Default I2C Address:0011010
- PG13
- PG14
- PF8
- PF9
- (near R222) PF7
- PC2
- PD6
- PF6
- PG6
- PC0
- (near JP16) MICBIAS1
- Operating range: 1.62<VDD<3.6V
- Title:
- Project:
- Size:
- Date:
- A3
- Reference:
- Sheet:
- Revision:
- of

### Library data of the parts
C102-C104 C108 C110 C118 = CAP: as C53 on sheet peripherals; Published: 8-Jun-2000; Revision: July-2002: Re-released for DXP Platform.; Publisher: Altium Limited
C105 C106 C109 C111 C120-C123 C125-C130 C139 C142 = Cap: as C52 on sheet peripherals; Published: 8-Jun-2000; Revision: July-2002: Re-released for DXP Platform.; Publisher: Altium Limited
CN20 CN21 = PJ3028B-3: ECCN_US/EU: NA; Ordered by: Subcon; Comments: Audio jack
JP14 JP16 = Jumper3: Ordered by: Subcon; ECCN_US/EU: NA
R191 R192 R195 R196 R198-R201 R205 R208 R220-R222 R225 R227 R238 = Res1: as R51 on sheet peripherals; Published: 8-Jun-2000; Revision: July-2002: Re-released for DXP Platform.; Publisher: Altium Limited
R197 = Res1: as R120 on sheet peripherals; Published: 8-Jun-2000; Revision: July-2002: Re-released for DXP Platform.; Publisher: Altium Limited
R224 R226 = Res1: as R63 on sheet peripherals; Published: 8-Jun-2000; Revision: July-2002: Re-released for DXP Platform.; Publisher: Altium Limited; Value: 1K
U29 = WM8994ECS/R: Manuf_1: Wolfson; Ordered by: Subcon; ECCN_US/EU: EAR99/NEC; Manuf_Part_1: WM8994ECS/R
U35 U36 = MP34DT01TR: MEMS audio sensor; Ordered by: ST; ECCN_US/EU: EAR99/NEC; Ref St: 9188008; Revision: 17-Jul-2002: Re-released for DXP Platform.; Publisher: Altium Limited; Manuf_1: ST; Manuf_Part_1: MP34DT01TR

## Sheet LCD_TFT.SchDoc: LCD_TFT
size A3; DocumentNumber: MB1144; Revision: C-02; SheetNumber: 11; SheetTotal: 25; PageSetup: Record=PageOptions|CenterHorizontal=True|CenterVertical=True|PrintScale=1.01|XCorrection=1.00|YCorrection=1.00|PrintKind=1|BorderSize=5000000|LeftOffset=0|BottomOffset=0|Orientation=2|PaperLength=1000|PaperWidth=1000|Scale=100|PaperSource=15|PrintQuality=600|MediaType=1|DitherType=10|PaperKind=A3|PrintScaleMode=1; Project: STM32L476G-EVAL; ModifiedDate: 9/23/2015
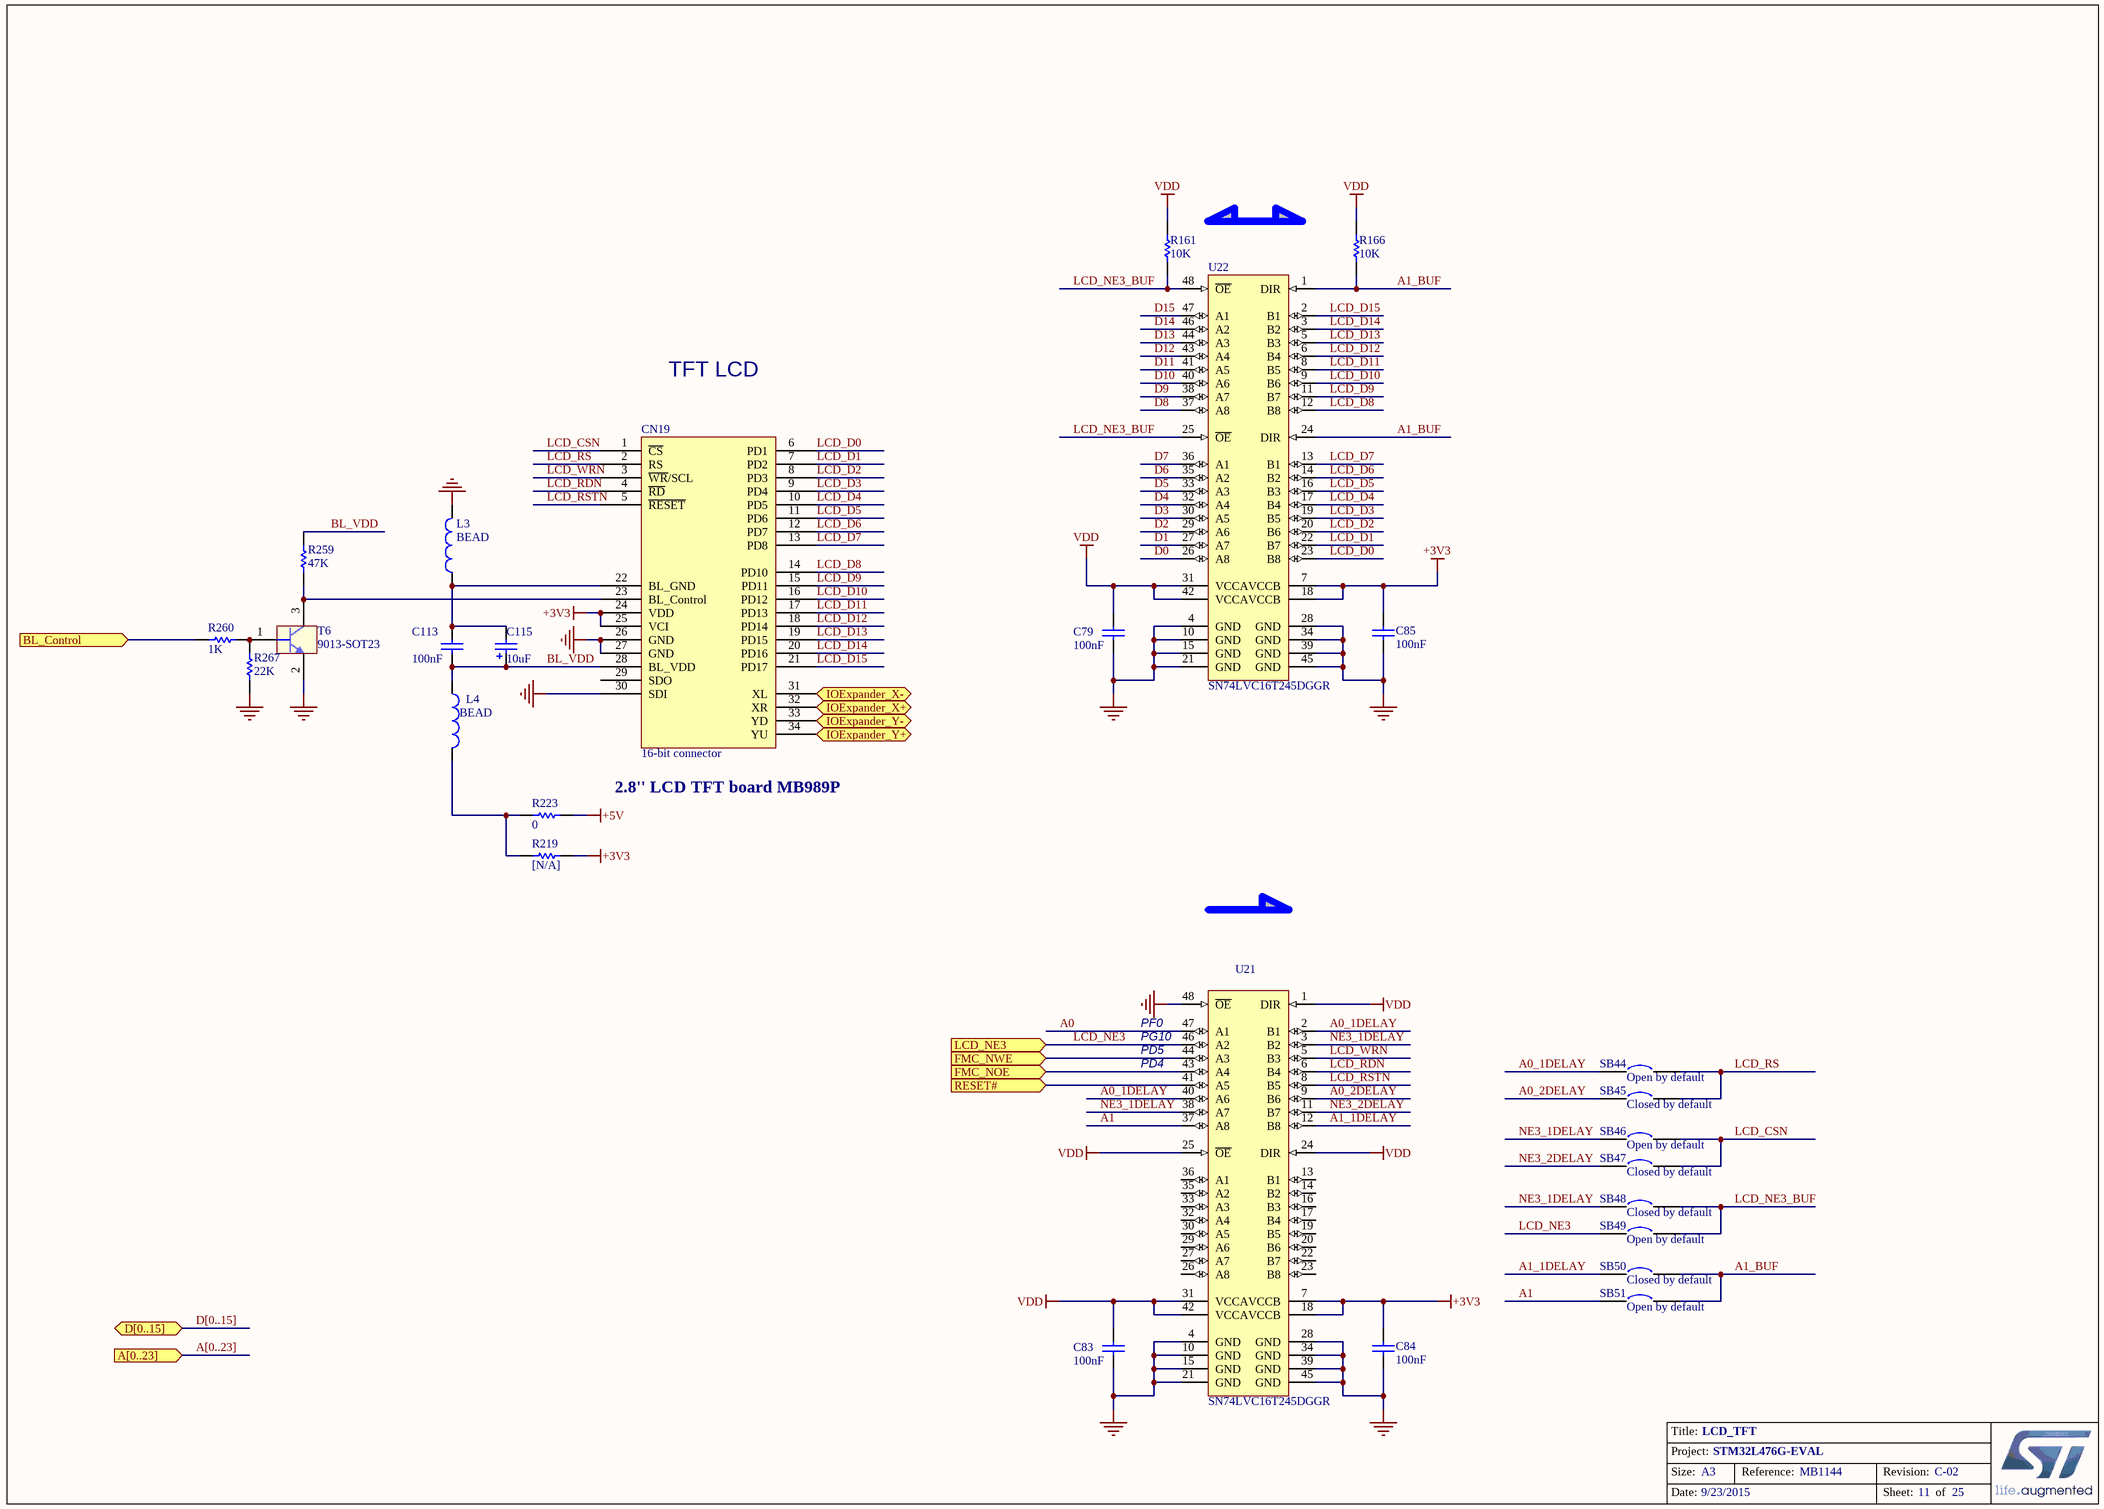
[diagram p23: LCD_TFT.SchDoc]

### Parts
C79  100nF  [0402C]
C83  100nF  [0402C]
C84  100nF  [0402C]
C85  100nF  [0402C]
C113  100nF  [0402C]
C115  10uF  [TAN-A]
CN19  16-bit connector  [HDR_2X17_2R54]
L3  BEAD  [0603L]
L4  BEAD  [0603L]
R161  10K  [0402R]
R166  10K  [0402R]
R219  [N/A]  [0603R]
R223  0  [0603R]
R259  47K  [0402R]
R260  1K  [0402R]
R267  22K  [0402R]
SB44  Open by default  [SB_0603]
SB45  Closed by default  [SB_0603]
SB46  Open by default  [SB_0603]
SB47  Closed by default  [SB_0603]
SB48  Closed by default  [SB_0603]
SB49  Open by default  [SB_0603]
SB50  Closed by default  [SB_0603]
SB51  Open by default  [SB_0603]
T6  9013-SOT23  [SOT-23]
U21  SN74LVC16T245DGGR  [TSSOP48_0R5_12R5X8R1]
U22  SN74LVC16T245DGGR  [TSSOP48_0R5_12R5X8R1]

### Ports
A[0..23] (in), BL_Control (in), D[0..15] (bidir), FMC_NOE (in), FMC_NWE (in), IOExpander_X+ (bidir), IOExpander_X- (bidir), IOExpander_Y+ (bidir), IOExpander_Y- (bidir), LCD_NE3 (in), RESET# (in)

### Nets
+3V3: C84.1 C85.1 CN19.24(VDD) CN19.25(VCI) R219.1 U21.7(VCCB) U21.18(VCCB) U22.7(VCCB) U22.18(VCCB)
+5V: R223.1
GND: C79.2 C83.2 C84.2 C85.2 CN19.26(GND) CN19.27(GND) CN19.30(SDI) L3.2 R267.2 T6.2(E) U21.4(GND) U21.10(GND) U21.15(GND) U21.21(GND) U21.28(GND) U21.34(GND) U21.39(GND) U21.45(GND) U21.48(~{OE}) U22.4(GND) U22.10(GND) U22.15(GND) U22.21(GND) U22.28(GND) U22.34(GND) U22.39(GND) U22.45(GND)
VDD: C79.1 C83.1 R161.1 R166.1 U21.1(DIR) U21.24(DIR) U21.25(~{OE}) U21.31(VCCA) U21.42(VCCA) U22.31(VCCA) U22.42(VCCA)
A0: U21.47(A1)
A0_1DELAY: SB44.1 U21.2(B1) U21.40(A6)
A0_2DELAY: SB45.1 U21.9(B6)
A1: SB51.1 U21.37(A8)
A1_1DELAY: SB50.1 U21.12(B8)
A1_BUF: R166.2 SB50.2 SB51.2 U22.1(DIR) U22.24(DIR)
BL_VDD: C113.2 C115.1 CN19.28(BL_VDD) L4.1 R259.1
D0: U22.26(A8)
D1: U22.27(A7)
D2: U22.29(A6)
D3: U22.30(A5)
D4: U22.32(A4)
D5: U22.33(A3)
D6: U22.35(A2)
D7: U22.36(A1)
D8: U22.37(A8)
D9: U22.38(A7)
D10: U22.40(A6)
D11: U22.41(A5)
D12: U22.43(A4)
D13: U22.44(A3)
D14: U22.46(A2)
D15: U22.47(A1)
LCD_CSN: CN19.1(~{CS}) SB46.2 SB47.2
LCD_D0: CN19.6(PD1) U22.23(B8)
LCD_D1: CN19.7(PD2) U22.22(B7)
LCD_D2: CN19.8(PD3) U22.20(B6)
LCD_D3: CN19.9(PD4) U22.19(B5)
LCD_D4: CN19.10(PD5) U22.17(B4)
LCD_D5: CN19.11(PD6) U22.16(B3)
LCD_D6: CN19.12(PD7) U22.14(B2)
LCD_D7: CN19.13(PD8) U22.13(B1)
LCD_D8: CN19.14(PD10) U22.12(B8)
LCD_D9: CN19.15(PD11) U22.11(B7)
LCD_D10: CN19.16(PD12) U22.9(B6)
LCD_D11: CN19.17(PD13) U22.8(B5)
LCD_D12: CN19.18(PD14) U22.6(B4)
LCD_D13: CN19.19(PD15) U22.5(B3)
LCD_D14: CN19.20(PD16) U22.3(B2)
LCD_D15: CN19.21(PD17) U22.2(B1)
LCD_NE3: SB49.1 U21.46(A2) ; port LCD_NE3
LCD_NE3_BUF: R161.2 SB48.2 SB49.2 U22.25(~{OE}) U22.48(~{OE})
LCD_RDN: CN19.4(~{RD}) U21.6(B4)
LCD_RS: CN19.2(RS) SB44.2 SB45.2
LCD_RSTN: CN19.5(~{RESET}) U21.8(B5)
LCD_WRN: CN19.3(~{WR}/SCL) U21.5(B3)
NE3_1DELAY: SB46.1 SB48.1 U21.3(B2) U21.38(A7)
NE3_2DELAY: SB47.1 U21.11(B7)
PD4: U21.43(A4) ; port FMC_NOE
PD5: U21.44(A3) ; port FMC_NWE
RESET#: U21.41(A5) ; port RESET#
NetC113_1: C113.1 C115.2 CN19.22(BL_GND) L3.1
NetCN19_23: CN19.23(BL_Control) R259.2 T6.3(C)
NetCN19_31: CN19.31(XL) ; port IOExpander_X-
NetCN19_32: CN19.32(XR) ; port IOExpander_X+
NetCN19_33: CN19.33(YD) ; port IOExpander_Y-
NetCN19_34: CN19.34(YU) ; port IOExpander_Y+
NetL4_2: L4.2 R219.2 R223.2
NetR260_1: R260.1 ; port BL_Control
NetR260_2: R260.2 R267.1 T6.1(B)

Not connected (* = marked no-connect by the designer): CN19 29(SDO); U21 13(B1) 14(B2) 16(B3) 17(B4) 19(B5) 20(B6) 22(B7) 23(B8) 26(A8) 27(A7) 29(A6) 30(A5) 32(A4) 33(A3) 35(A2) 36(A1)

### Buses and harness runs
bus A[0..23] = port A[0..23]
bus D[0..15] = port D[0..15]

### Notes on the sheet
- TFT LCD
- 2.8'' LCD TFT board MB989P
- (near U21) PG10
- (near U21) PD5
- (near U21) PF0
- (near U21) PD4
- Title:
- Project:
- Size:
- Date:
- A3
- Reference:
- Sheet:
- Revision:
- of

### Library data of the parts
C79 C83-C85 = CAP: as C124 on sheet Power; Published: 8-Jun-2000; Revision: July-2002: Re-released for DXP Platform.; Publisher: Altium Limited
C113 = Cap: as C52 on sheet peripherals; Published: 8-Jun-2000; Revision: July-2002: Re-released for DXP Platform.; Publisher: Altium Limited
C115 = Cap Pol1: as C107 on sheet Power; Published: 8-Jun-2000; Revision: July-2002: Re-released for DXP Platform.; Publisher: Altium Limited; Value: 10uF
CN19 = ColorLCD_module_16bits: Female connector 2x17; Ordered by: Subcon; Comments: LCD TFT paralell; Assembly: with MB989P revB; ECCN_US/EU: NA
L3 L4 = Inductor: as L1 on sheet Power; Published: 8-Jun-2000; Revision: July-2002: Re-released for DXP Platform.; Publisher: Altium Limited
R161 R166 R267 = res1: as R245 on sheet peripherals; Published: 8-Jun-2000; Revision: July-2002: Re-released for DXP Platform.; Publisher: Altium Limited
R219 = Res1: as R120 on sheet peripherals; Published: 8-Jun-2000; Revision: July-2002: Re-released for DXP Platform.; Publisher: Altium Limited
R223 R259 = Res1: as R51 on sheet peripherals; Published: 8-Jun-2000; Revision: July-2002: Re-released for DXP Platform.; Publisher: Altium Limited
R260 = Res1: as R63 on sheet peripherals; Published: 8-Jun-2000; Revision: July-2002: Re-released for DXP Platform.; Publisher: Altium Limited; Value: 1K
SB44 SB46 SB49 SB51 = Circuit Breaker: Ordered by: Subcon; Comments: Solder bridge; Fitted: NO; ECCN_US/EU: NA; Published: 24-Mar-1999; Revision: July-2002: Re-released for DXP Platform.; Publisher: Altium Limited
SB45 SB47 SB48 SB50 = Circuit Breaker: Ordered by: Subcon; Comments: Solder bridge; ECCN_US/EU: NA; Published: 24-Mar-1999; Revision: July-2002: Re-released for DXP Platform.; Publisher: Altium Limited
T6 = 9013-SOT23: NPN Bipolar Transistor; Manuf_1: Taitron; Manuf_Part_1: MMBT9013; Description: NPN Bipolar Transistor, SOT-23 Footprint; Ordered by: Subcon; ECCN_US/EU: EAR99/NEC; Revision: July-2002: Re-released for DXP Platform.; Order: MMBT9013
U21 U22 = SN74LVC16T245: Manuf_1: TI; Ordered by: Subcon; ECCN_US/EU: EAR99/NEC; Manuf_Part_1: SN74LVC16T245DGGR

## Sheet RF_I2C_EEPROM.SchDoc: RF_I2C_EEPROM
size A4; DocumentNumber: MB1144; Revision: C-02; SheetNumber: 22; SheetTotal: 25; Project: STM32L476G-EVAL; ModifiedDate: 9/23/2015
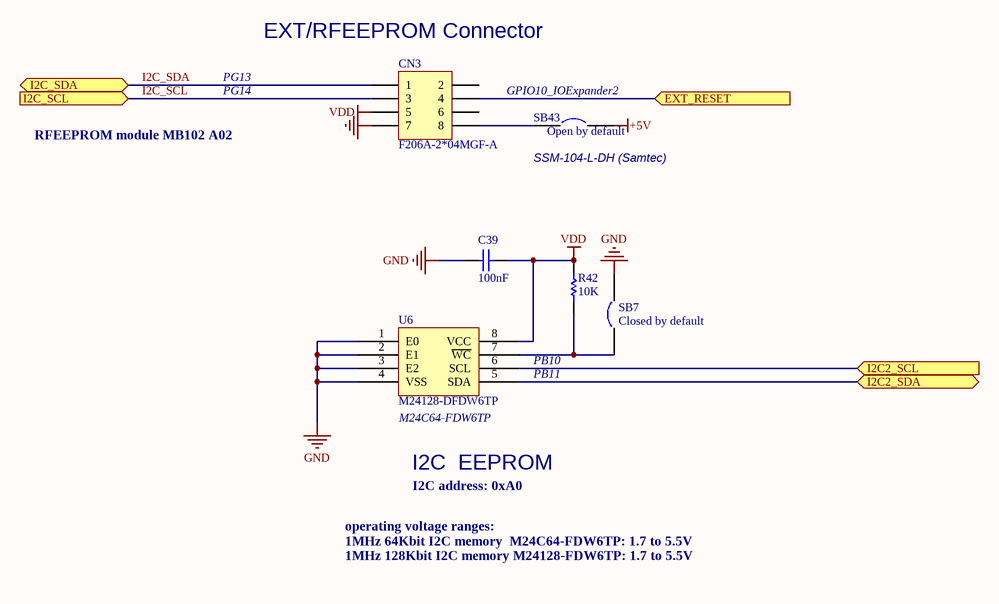
[diagram p24: RF_I2C_EEPROM.SchDoc]

### Parts
C39  100nF  [0402C]
CN3  F206A-2*04MGF-A  [SSM-104-L-DH]
R42  10K  [0402R]
SB7  Closed by default  [SB_0603]
SB43  Open by default  [SB_0603]
U6  M24128-DFDW6TP  [TSSOP8_0R65_3X6R4]

### Ports
EXT_RESET (in), I2C2_SCL (in), I2C2_SDA (bidir), I2C_SCL (in), I2C_SDA (bidir)

### Nets
+5V: SB43.2
GND: C39.1 CN3.7 SB7.2 U6.1(E0) U6.2(E1) U6.3(E2) U6.4(VSS)
VDD: C39.2 CN3.5 R42.1 U6.8(VCC)
I2C_SCL: CN3.3 ; port I2C_SCL
I2C_SDA: CN3.1 ; port I2C_SDA
NetCN3_4: CN3.4 ; port EXT_RESET
NetCN3_8: CN3.8 SB43.1
NetR42_2: R42.2 SB7.1 U6.7(~{WC})
NetR263_2: U6.5(SDA) ; port I2C2_SDA
NetR264_2: U6.6(SCL) ; port I2C2_SCL

Not connected (* = marked no-connect by the designer): CN3 2 6

### Notes on the sheet
- PG13
- (near CN3) EXT/RFEEPROM Connector
- RFEEPROM module MB102 A02
  I2C address: 0xA6
- PG14
- (near SB43) GPIO10_IOExpander2
- SSM-104-L-DH (Samtec)
- PB11
- PB10
- (near U6) M24C64-FDW6TP
- I2C  EEPROM
- I2C address: 0xA0
- operating voltage ranges:
  1MHz 64Kbit I2C memory  M24C64-FDW6TP: 1.7 to 5.5V
  1MHz 128Kbit I2C memory M24128-FDW6TP: 1.7 to 5.5V
- Title:
- Project:
- Size:
- Date:
- A4
- Reference:
- Sheet:
- Revision:
- of

### Library data of the parts
C39 = CAP: as C124 on sheet Power; Published: 8-Jun-2000; Revision: July-2002: Re-released for DXP Platform.; Publisher: Altium Limited
CN3 = SSM-104-L-DH: Header, 5-Pin, Dual row; Ordered by: Subcon; Comments: EXT/RF E2P connector; ECCN_US/EU: NA; Assembly: with MB1020 A02; Revision: 17-Jul-2002: Re-released for DXP Platform.; Publisher: Altium Limited; Samtec components: SSM-104-L-DH
R42 = Res1: as R51 on sheet peripherals; Published: 8-Jun-2000; Revision: July-2002: Re-released for DXP Platform.; Publisher: Altium Limited
SB7 = Circuit Breaker: as SB45 on sheet LCD_TFT; Published: 24-Mar-1999; Revision: July-2002: Re-released for DXP Platform.; Publisher: Altium Limited
SB43 = Circuit Breaker: as SB44 on sheet LCD_TFT; Published: 24-Mar-1999; Revision: July-2002: Re-released for DXP Platform.; Publisher: Altium Limited
U6 = M24C64-WMN6: Ordered by: ST; ECCN_US/EU: EAR99/NEC; Ref St: 9175653; Manuf_1: ST; Manuf_Part_1: M24128-DFDW6TP